# EAGLE board PinHeck (EAGLE 7.4.0), part 1 of 3
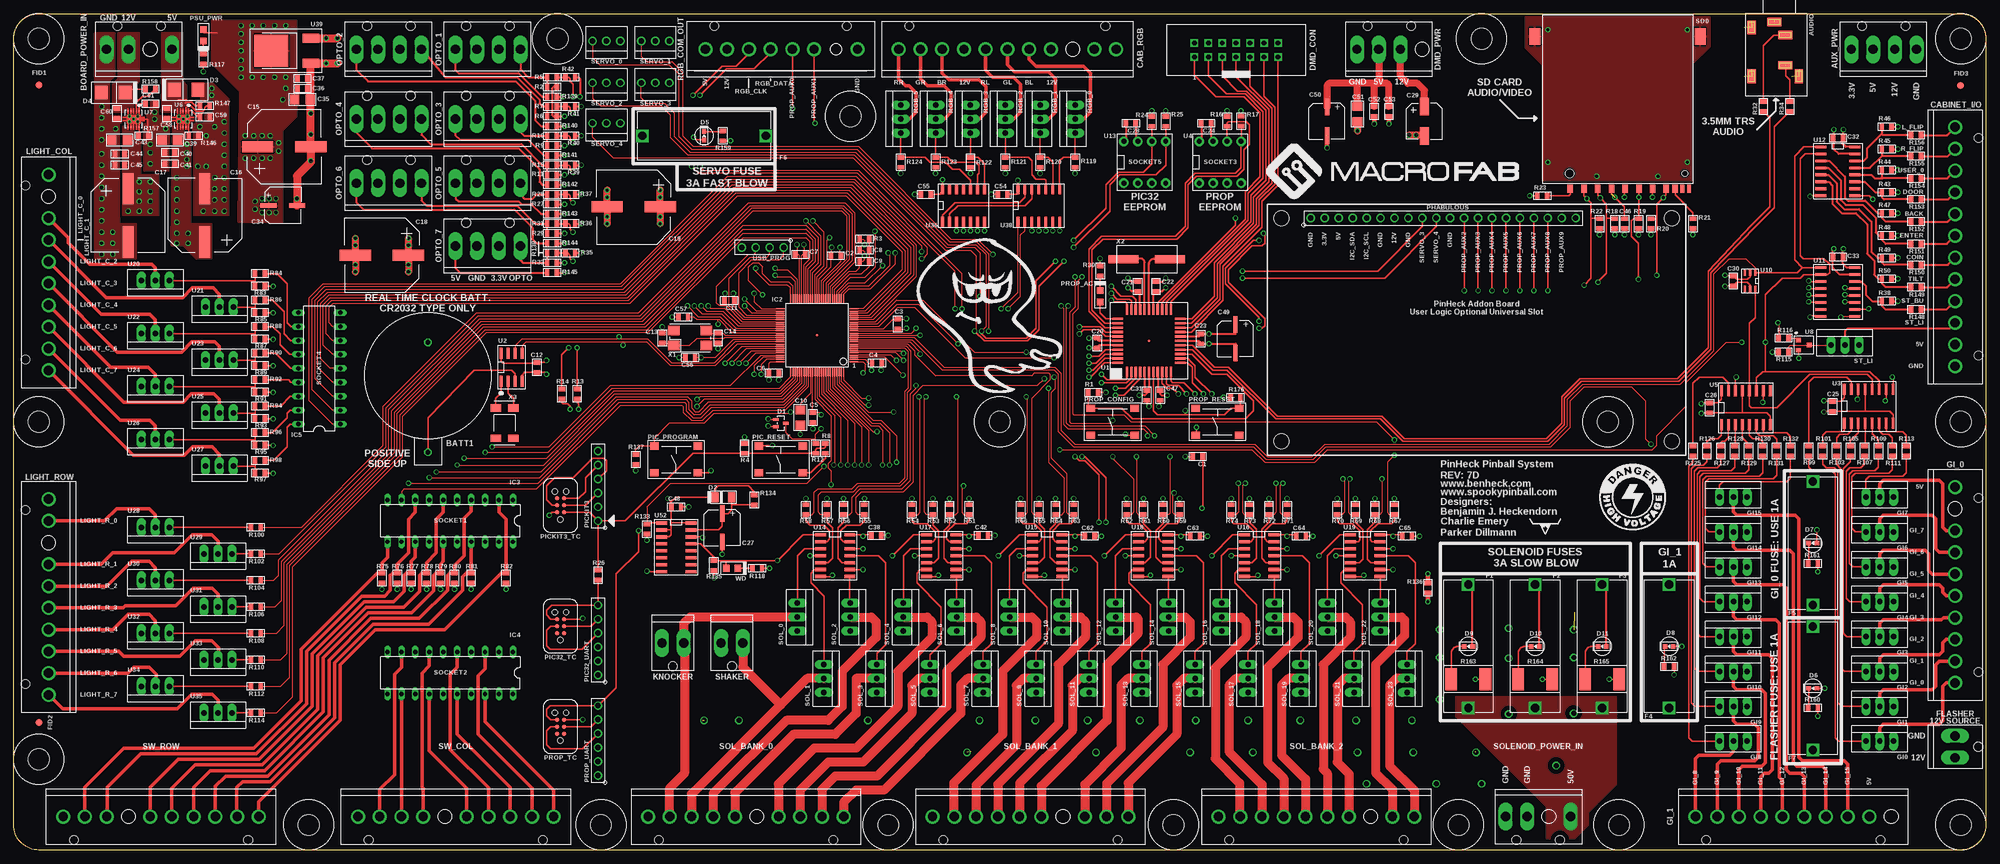
[diagram p8: board, top side]
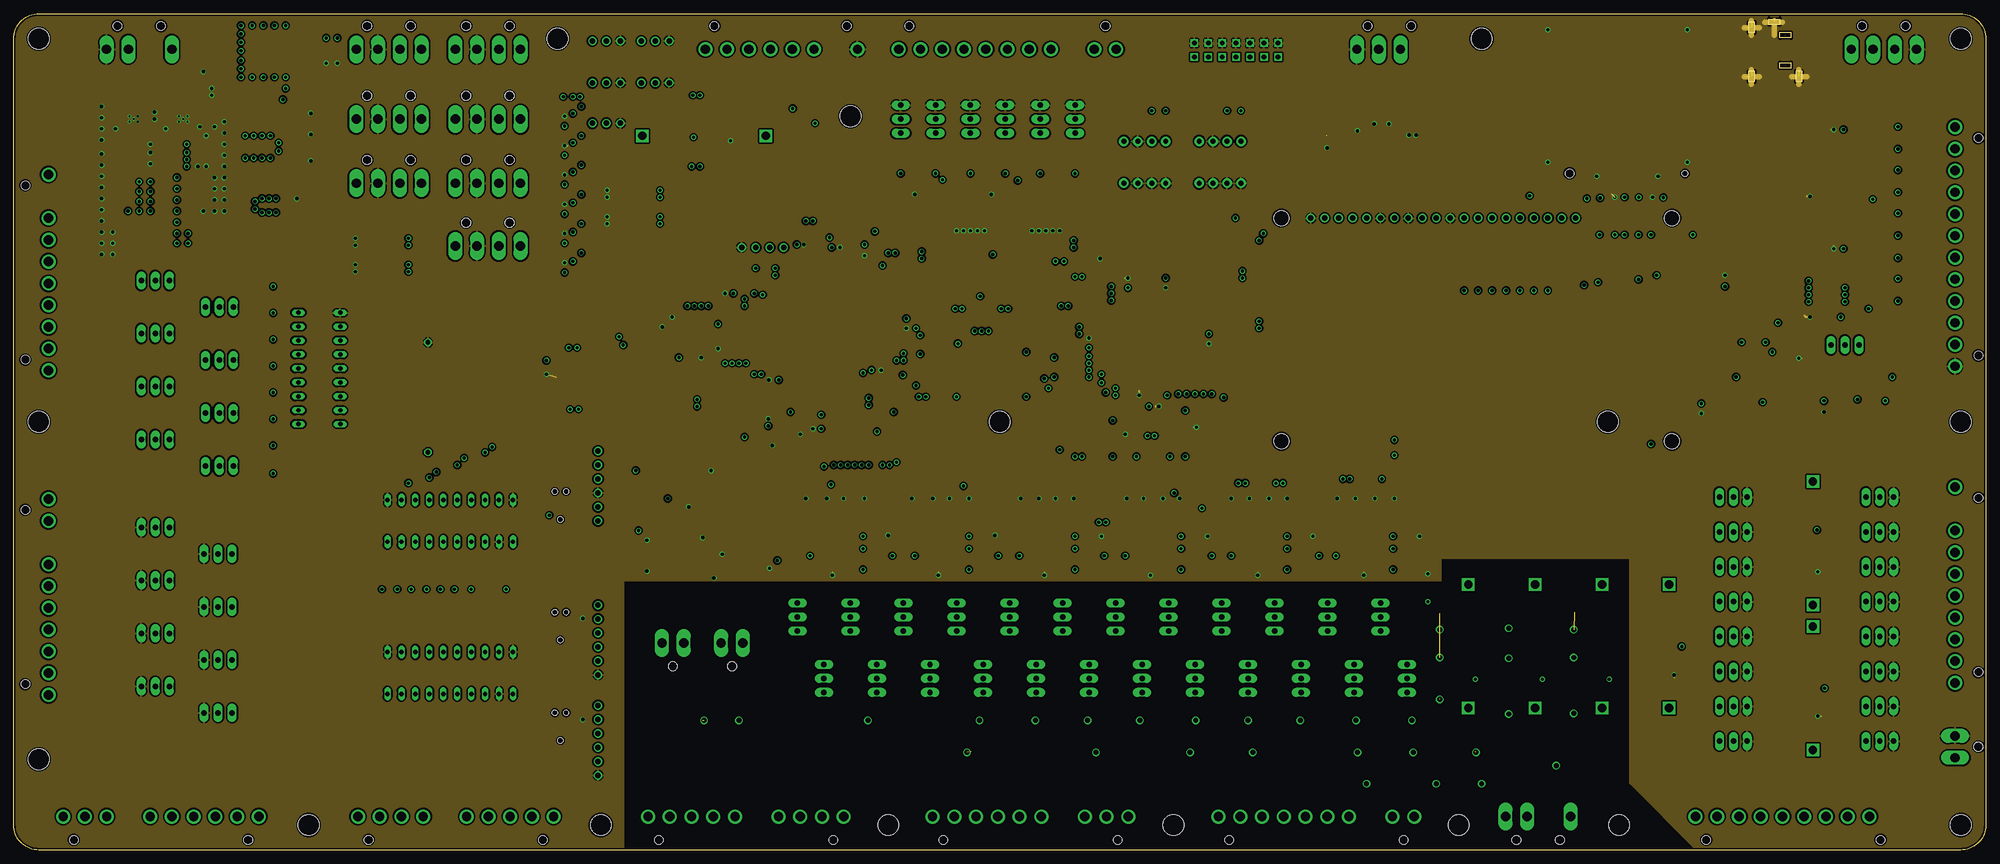
[diagram p9: board, inner layer GND]
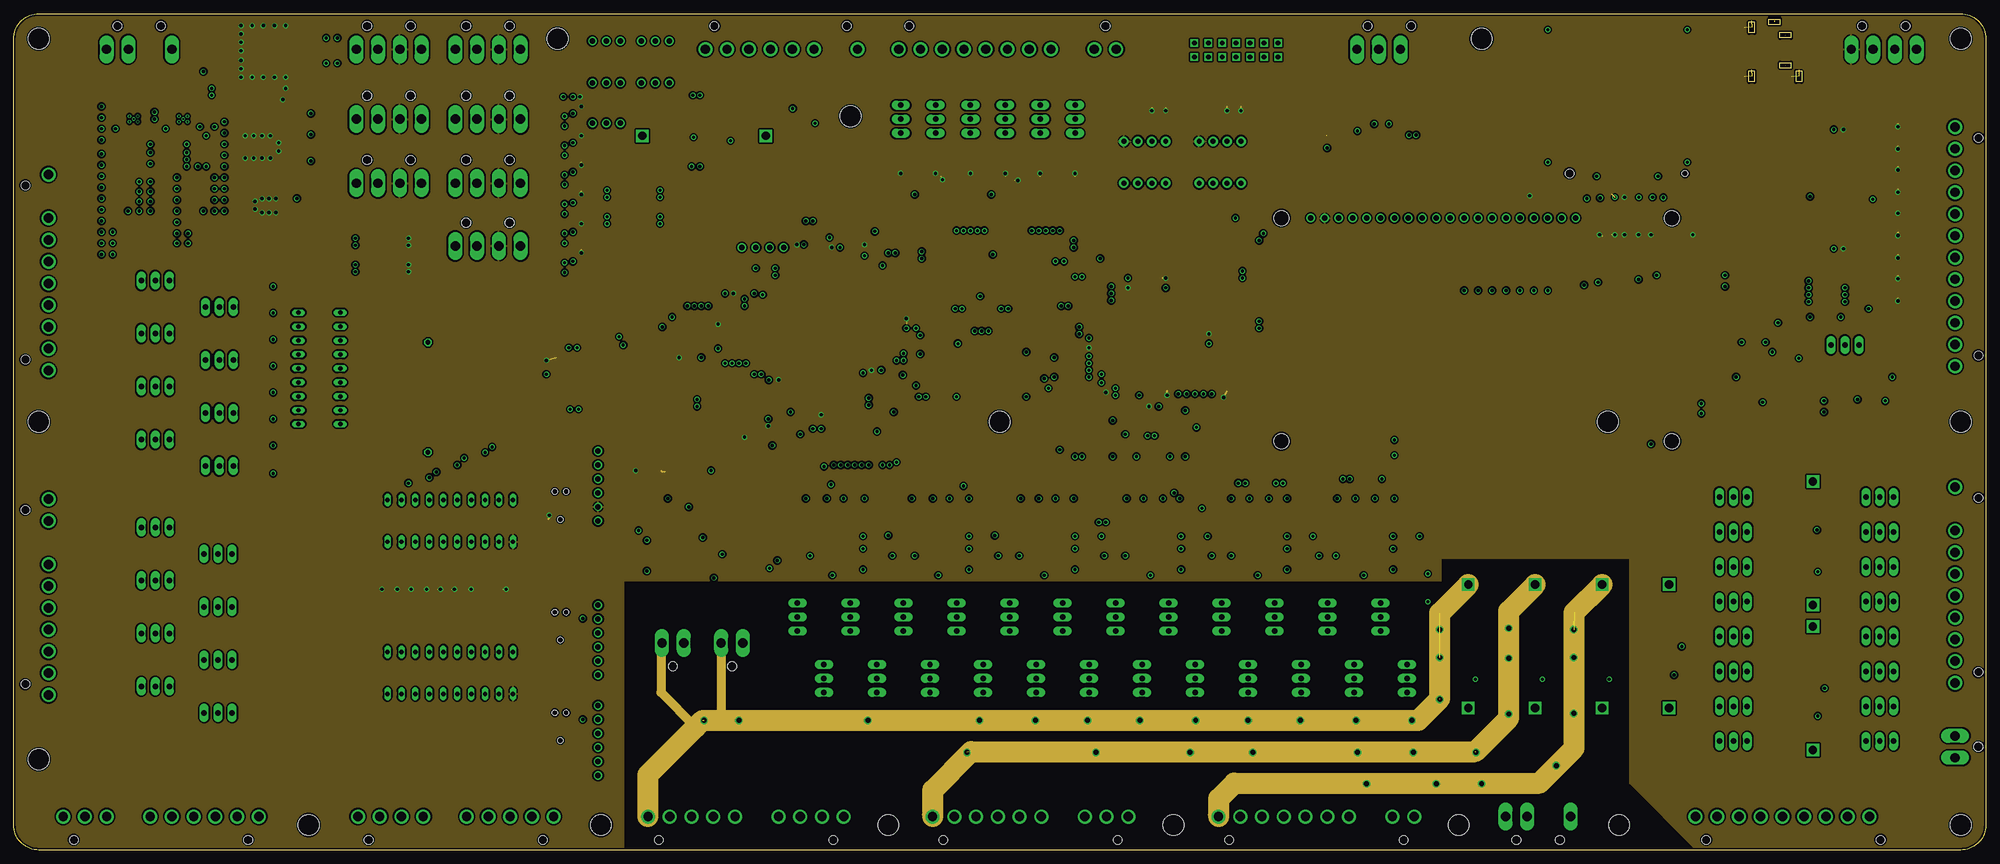
[diagram p10: board, inner layer 3.3V]
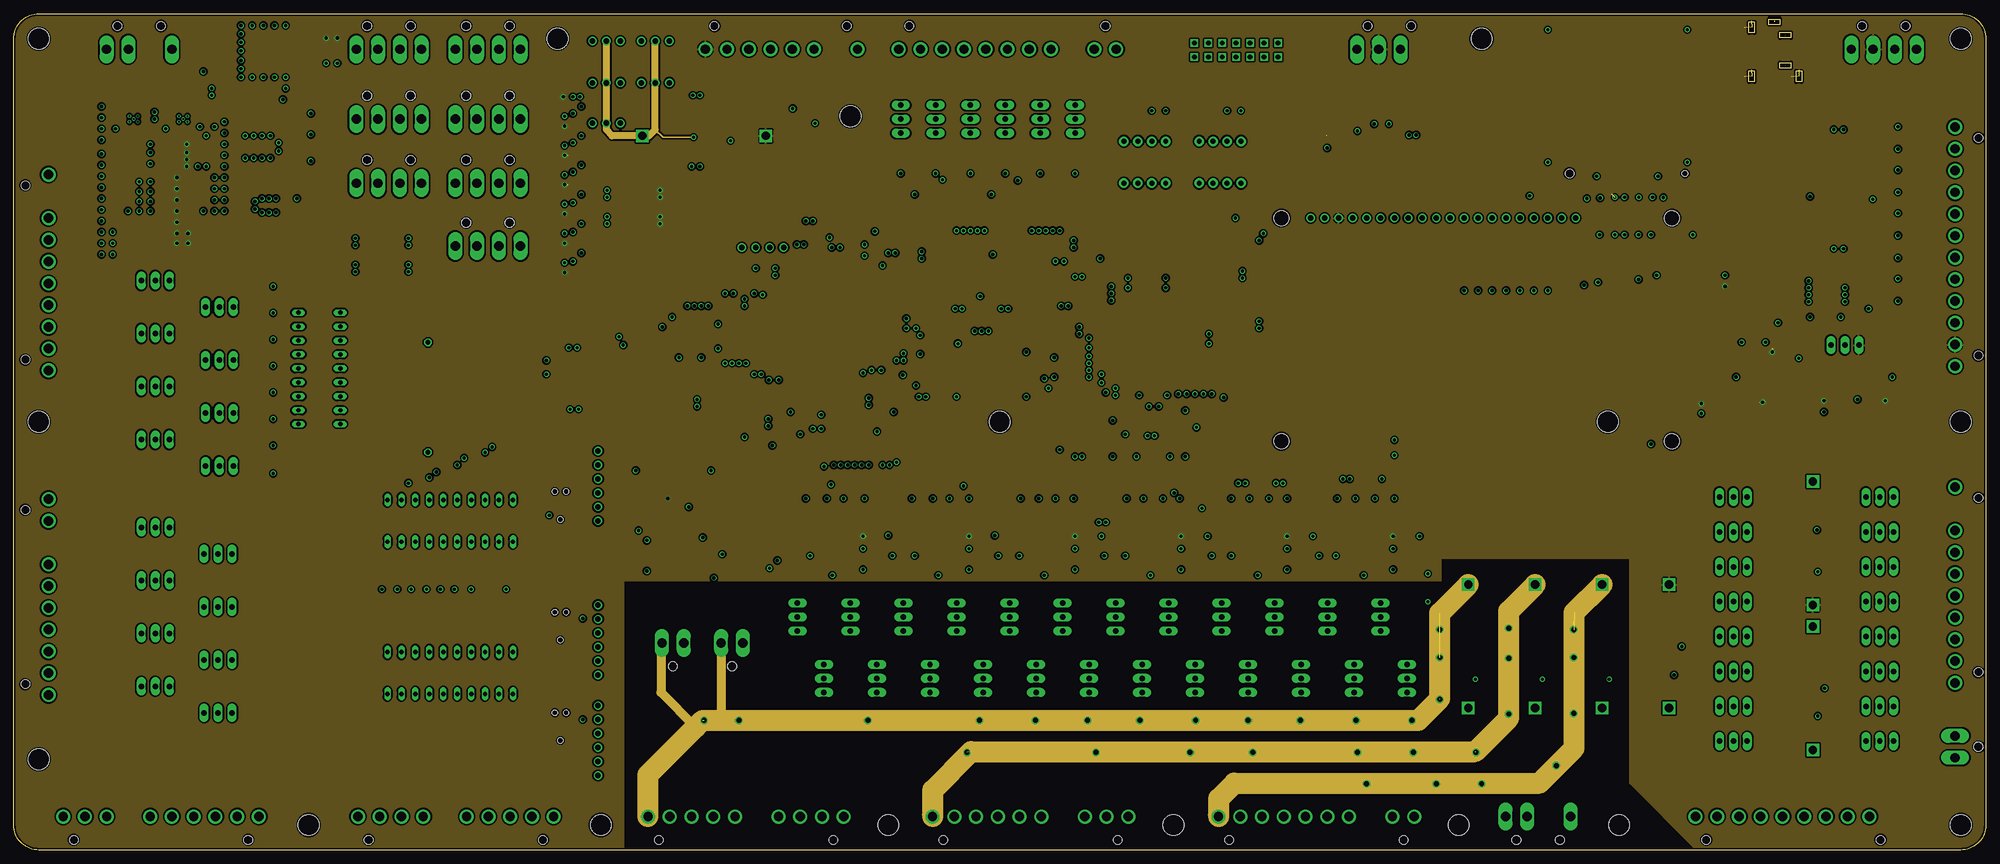
[diagram p11: board, inner layer 5V]
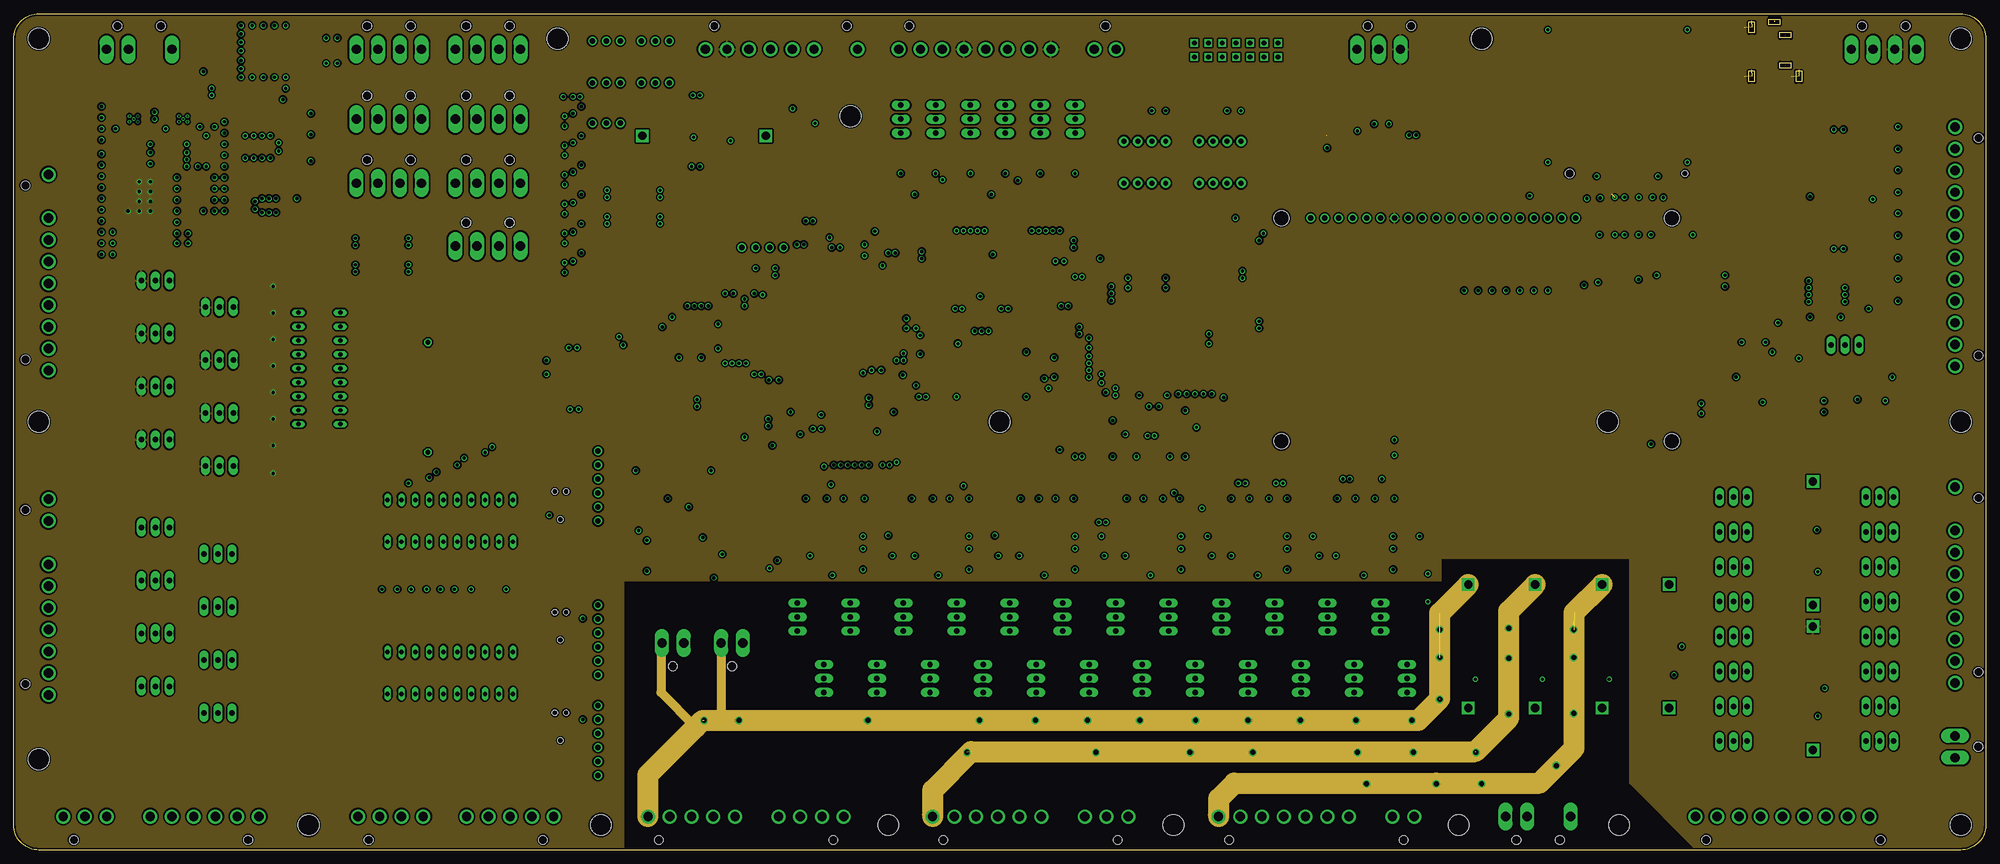
[diagram p12: board, inner layer 12V]
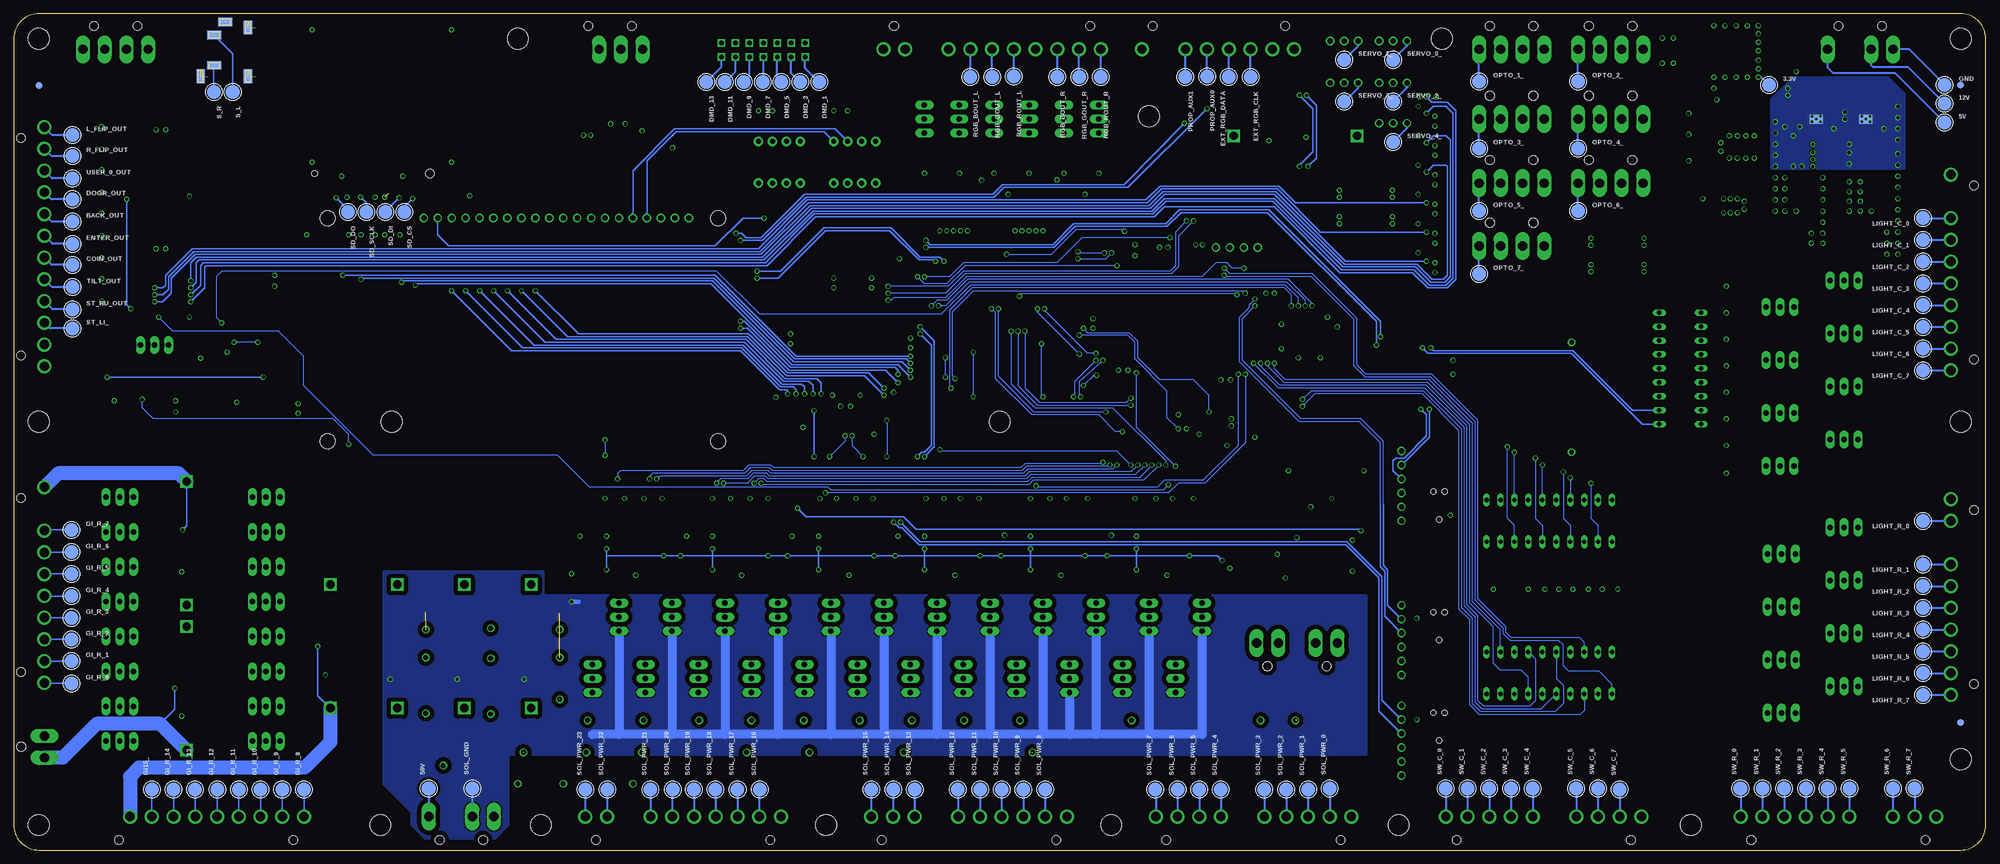
[diagram p13: board, bottom side, seen from below]

Size 359.16 x 152.27 mm. Coordinates in mm from the lower left corner, seen from the top.
Outline: 354.58,152.27 arc-90 359.16,147.7 359.16,4.57 arc-90 354.58,0 4.57,0 arc-90 0,4.57 0,147.7 arc-90 4.57,152.27 354.58,152.27
Copper layers (1*2*3*14*15*16): Top 0.035mm / dielectric 0.23mm / GND 0.035mm / dielectric 0.38mm / 3.3V 0.035mm / dielectric 0.15mm / 5V 0.035mm / dielectric 0.38mm / 12V 0.035mm / dielectric 0.23mm / Bottom 0.035mm
Design rules "MF_Standard_6_Layer": minimum track width 6mil, minimum drill 12mil, track to track 6mil, track to pad 6mil, pad to pad 6mil, via to via 6mil, smd to smd 0mil, copper to edge 10mil, drill to drill 10mil, minimum pad ring 6mil, minimum via ring 6mil, stop-mask expansion 2mil, vias tented up to drill 25mil, thermal gap 10mil
Net classes: 0 default: width 0.178 mm, drill 0.5 mm, clearance 0.178 mm
Holes 2.8 mm at 302.01,115.06 302.01,74.42 230.89,74.42 230.89,115.06

## Footprints (pad centres in the part's own frame; a part is rotated, then mirrored left to right if it is on the bottom)
100MIL_TP = smd 2.54 x 2.54: P$1 0,0
SJ1-3533NS = smd 1.5 x 2.5: 1_A -6,-0.4; 2_A -3.6,1.6; 3_A 1.9,1.6 | smd 1.5 x 2.5 bottom: 1_B -6,-0.4; 2_B -3.6,1.6; 3_B 1.9,1.6 | smd 2.5 x 1.5: S1 -5,-4.55; S2 3.9,-4.55; S3 3.9,4.05 | smd 2.5 x 1.5 bottom: S4 3.9,4.05; S5 3.9,-4.55; S6 -5,-4.55
26-64-4040 = drill 1.702 long: 1 -5.94,0; 2 -1.98,0; 3 1.98,0; 4 5.94,0 | hole 1.6: 3.96,-4.24; -3.96,-4.24
1066 = drill 0.889 octagon: NEG -6.071,0; POS 13.919,0
26-64-4040(KEYPIN2) = drill 1.702 long: 1 -5.94,0; 3 1.98,0; 4 5.94,0 | hole 1.6: 3.96,-4.24; -3.96,-4.24
0805 = smd 0.8 x 1.2: 1 -0.9,0; 2 0.9,0
1206 = smd 1.6 x 1.8: 1 -1.4,0; 2 1.4,0
CP12.5MM = smd 2 x 5.7: P$1 0,-4.85; P$2 0,4.85
6.3MM_CAP_SMD = smd 0.8 x 3: NEG 0,-2.6; POS 0,2.6
CP6.3MM = smd 1.6 x 3.2: P$1 0,-2.7; P$2 0,2.7
26-64-4110(KEYPIN3) = drill 1.7: P$1 -19.8,0; P$2 -15.84,0; P$3 -7.92,0; P$4 -3.96,0; P$5 0,0; P$6 3.96,0; P$7 7.92,0; P$8 11.88,0; P$9 15.84,0; P$10 19.8,0 | hole 1.6: -17.855,-4.24; 17.855,-4.24
26-64-4120 = drill 1.7: P$1 -21.78,0; P$2 -17.82,0; P$3 -13.86,0; P$4 -9.9,0; P$5 -5.94,0; P$6 -1.98,0; P$7 1.98,0; P$8 5.94,0; P$9 9.9,0; P$10 13.86,0; P$11 17.82,0; P$12 21.78,0 | hole 1.6: -19.8,-4.24; 19.8,-4.24
SOT-323 = smd 0.5 x 1: 1 -0.65,-0.9; 2 0.65,-0.9; 3 0,0.9
SOD-123 = smd 1.3 x 1.8: 1 -1.27,0; 2 1.73,0
SMBJ = smd 2.3 x 2.5: ANODE 2.15,0; CATH -2.15,0
LED0603 = smd 0.8 x 0.8: ANODE 0.75,0; CATHODE -0.75,0
5103308-2 = drill 0.9 square: 1 7.62,1.27; 2 7.62,-1.27; 3 5.08,1.27; 4 5.08,-1.27; 5 2.54,1.27; 6 2.54,-1.27; 7 0,1.27; 8 0,-1.27; 9 -2.54,1.27; 10 -2.54,-1.27; 11 -5.08,1.27; 12 -5.08,-1.27; 13 -7.62,1.27; 14 -7.62,-1.27
26-64-4040(KEYPIN1) = drill 1.702 long: 2 -1.98,0; 3 1.98,0; 4 5.94,0 | hole 1.6: 3.96,-4.24; -3.96,-4.24
4628 = drill 1.524 square: P$1 -11.252,0; P$2 11.252,0
FIDUCIAL_100MIL = smd 1.27 x 1.27: P$1 0,0 | smd 1.27 x 1.27 bottom: P$2 0,0
FIDUCIAL_0.5MM = smd 0.5 x 0.5: FID 0,0
26-64-4020 = drill 1.7 long: P$1 -1.98,0; P$2 1.98,0 | hole 1.63: 0,-4.24
TO-220AB = drill 1 pad 1.676 long: D 0,0; G 2.54,0; S -2.54,0
26-64-4100(KEYPIN9) = drill 1.7: P$1 -17.82,0; P$2 -13.86,0; P$3 -9.9,0; P$4 -5.94,0; P$5 -1.98,0; P$6 1.98,0; P$7 5.94,0; P$8 9.9,0; P$10 17.82,0 | hole 1.6: -15.875,-4.24; 15.875,-4.24
26-64-4100(KEYPIN10) = drill 1.7: P$1 -17.82,0; P$2 -13.86,0; P$3 -9.9,0; P$4 -5.94,0; P$5 -1.98,0; P$6 1.98,0; P$7 5.94,0; P$8 9.9,0; P$9 13.86,0 | hole 1.6: -15.875,-4.24; 15.875,-4.24
MOUNT_HOLE_150MIL = hole 3.81: 0,0
TQ100-PT = smd 1.5 x 0.2: 1 -6.7,4.8; 2 -6.7,4.4; 3 -6.7,4; 4 -6.7,3.6; 5 -6.7,3.2; 6 -6.7,2.8; 7 -6.7,2.4; 8 -6.7,2; 9 -6.7,1.6; 10 -6.7,1.2; 11 -6.7,0.8; 12 -6.7,0.4; 13 -6.7,0; 14 -6.7,-0.4; 15 -6.7,-0.8; 16 -6.7,-1.2; 17 -6.7,-1.6; 18 -6.7,-2; 19 -6.7,-2.4; 20 -6.7,-2.8; 21 -6.7,-3.2; 22 -6.7,-3.6; 23 -6.7,-4; 24 -6.7,-4.4; 25 -6.7,-4.8; 51 6.7,-4.8; 52 6.7,-4.4; 53 6.7,-4; 54 6.7,-3.6; 55 6.7,-3.2; 56 6.7,-2.8; 57 6.7,-2.4; 58 6.7,-2; 59 6.7,-1.6; 60 6.7,-1.2; 61 6.7,-0.8; 62 6.7,-0.4; 63 6.7,0; 64 6.7,0.4; 65 6.7,0.8; 66 6.7,1.2; 67 6.7,1.6; 68 6.7,2; 69 6.7,2.4; 70 6.7,2.8; 71 6.7,3.2; 72 6.7,3.6; 73 6.7,4; 74 6.7,4.4; 75 6.7,4.8 | smd 0.2 x 1.5: 26 -4.8,-6.7; 27 -4.4,-6.7; 28 -4,-6.7; 29 -3.6,-6.7; 30 -3.2,-6.7; 31 -2.8,-6.7; 32 -2.4,-6.7; 33 -2,-6.7; 34 -1.6,-6.7; 35 -1.2,-6.7; 36 -0.8,-6.7; 37 -0.4,-6.7; 38 0,-6.7; 39 0.4,-6.7; 40 0.8,-6.7; 41 1.2,-6.7; 42 1.6,-6.7; 43 2,-6.7; 44 2.4,-6.7; 45 2.8,-6.7; 46 3.2,-6.7; 47 3.6,-6.7; 48 4,-6.7; 49 4.4,-6.7; 50 4.8,-6.7; 76 4.8,6.7; 77 4.4,6.7; 78 4,6.7; 79 3.6,6.7; 80 3.2,6.7; 81 2.8,6.7; 82 2.4,6.7; 83 2,6.7; 84 1.6,6.7; 85 1.2,6.7; 86 0.8,6.7; 87 0.4,6.7; 88 0,6.7; 89 -0.4,6.7; 90 -0.8,6.7; 91 -1.2,6.7; 92 -1.6,6.7; 93 -2,6.7; 94 -2.4,6.7; 95 -2.8,6.7; 96 -3.2,6.7; 97 -3.6,6.7; 98 -4,6.7; 99 -4.4,6.7; 100 -4.8,6.7
DIL20 = drill 0.813 long: 1 -11.43,-3.81; 2 -8.89,-3.81; 3 -6.35,-3.81; 4 -3.81,-3.81; 5 -1.27,-3.81; 6 1.27,-3.81; 7 3.81,-3.81; 8 6.35,-3.81; 9 8.89,-3.81; 10 11.43,-3.81; 11 11.43,3.81; 12 8.89,3.81; 13 6.35,3.81; 14 3.81,3.81; 15 1.27,3.81; 16 -1.27,3.81; 17 -3.81,3.81; 18 -6.35,3.81; 19 -8.89,3.81; 20 -11.43,3.81
DIL18 = drill 0.813 long: 1 -10.16,-3.81; 2 -7.62,-3.81; 3 -5.08,-3.81; 4 -2.54,-3.81; 5 0,-3.81; 6 2.54,-3.81; 7 5.08,-3.81; 8 7.62,-3.81; 9 10.16,-3.81; 10 10.16,3.81; 11 7.62,3.81; 12 5.08,3.81; 13 2.54,3.81; 14 0,3.81; 15 -2.54,3.81; 16 -5.08,3.81; 17 -7.62,3.81; 18 -10.16,3.81
26-64-4100(KEYPIN2) = drill 1.7: P$1 -17.82,0; P$3 -9.9,0; P$4 -5.94,0; P$5 -1.98,0; P$6 1.98,0; P$7 5.94,0; P$8 9.9,0; P$9 13.86,0; P$10 17.82,0 | hole 1.6: -15.875,-4.24; 15.875,-4.24
26-64-4100(KEYPIN3) = drill 1.7: P$1 -17.82,0; P$2 -13.86,0; P$4 -5.94,0; P$5 -1.98,0; P$6 1.98,0; P$7 5.94,0; P$8 9.9,0; P$9 13.86,0; P$10 17.82,0 | hole 1.6: -15.875,-4.24; 15.875,-4.24
2.54MM_01X20_PIN_HEADER = drill 1: 1 -24.13,0; 2 -21.59,0; 3 -19.05,0; 4 -16.51,0; 5 -13.97,0; 6 -11.43,0; 7 -8.89,0; 8 -6.35,0; 9 -3.81,0; 10 -1.27,0; 11 1.27,0; 12 3.81,0; 13 6.35,0; 14 8.89,0; 15 11.43,0; 16 13.97,0; 17 16.51,0; 18 19.05,0; 19 21.59,0; 20 24.13,0
TC2030 = smd 0.787 x 0.787: P$1 -1.27,-0.635; P$2 -1.27,0.635; P$3 0,-0.635; P$4 0,0.635; P$5 1.27,-0.635; P$6 1.27,0.635 | hole 0.991: 2.54,1.016; 2.54,-1.016; -2.54,0
2.54MM_01X06_PIN_HEADER = drill 1: 1 -6.35,0; 2 -3.81,0; 3 -1.27,0; 4 1.27,0; 5 3.81,0; 6 6.35,0
TACT6MM = smd 1.55 x 1.3: P$1 -3.975,2.45; P$2 3.975,2.45; P$3 -3.975,-2.45; P$4 3.975,-2.45
LED_0805 = smd 1.2 x 1.2: ANODE 1.05,0; CATHODE -1.05,0
2512 = smd 2.1 x 4: 1 -3.1,0; 2 3.1,0
26-64-4080(KEYPIN2) = drill 1.7: P$1 -13.86,0; P$2 -5.94,0; P$3 -1.98,0; P$4 1.98,0; P$5 5.94,0; P$6 9.9,0; P$7 13.86,0 | hole 1.6: -11.915,-4.24; 12.215,-4.24
SD-RSMT-2-MQ = smd 1 x 1.5: 1 6.88,0; 2 4.38,0; 3 1.88,0; 4 -0.62,0; 5 -3.12,0; 6 -5.62,0; 7 -8.05,0; 8 -9.75,0; 9 9.38,0 | smd 0.7 x 1.5: CARD_DETECT -11.05,0; WP -12.25,0 | smd 2 x 3: GND_1 -14.28,-27.75; GND_2 15.82,-27.75 | hole 1.6: 9.5,-2.8 | hole 1.1: -11.5,-2.8
640454-3 = drill 1: P$1 -2.54,0; P$2 0,0; P$3 2.54,0
26-64-4100(KEYPIN6) = drill 1.7: P$1 -17.82,0; P$2 -13.86,0; P$3 -9.9,0; P$4 -5.94,0; P$5 -1.98,0; P$7 5.94,0; P$8 9.9,0; P$9 13.86,0; P$10 17.82,0 | hole 1.6: -15.875,-4.24; 15.875,-4.24
26-64-4100(KEYPIN7) = drill 1.7: P$1 -17.82,0; P$2 -13.86,0; P$3 -9.9,0; P$4 -5.94,0; P$5 -1.98,0; P$6 1.98,0; P$8 9.9,0; P$9 13.86,0; P$10 17.82,0 | hole 1.6: -15.875,-4.24; 15.875,-4.24
26-64-4100(KEYPIN8) = drill 1.7: P$1 -17.82,0; P$2 -13.86,0; P$3 -9.9,0; P$4 -5.94,0; P$5 -1.98,0; P$6 1.98,0; P$7 5.94,0; P$9 13.86,0; P$10 17.82,0 | hole 1.6: -15.875,-4.24; 15.875,-4.24
26-64-4040(KEYPIN3) = drill 1.702 long: 1 -5.94,0; 2 -1.98,0; 4 5.94,0 | hole 1.6: 3.96,-4.24; -3.96,-4.24
26-64-4100(KEYPIN5) = drill 1.7: P$1 -17.82,0; P$2 -13.86,0; P$3 -9.9,0; P$4 -5.94,0; P$6 1.98,0; P$7 5.94,0; P$8 9.9,0; P$9 13.86,0; P$10 17.82,0 | hole 1.6: -15.875,-4.24; 15.875,-4.24
26-64-4100(KEYPIN4) = drill 1.7: P$1 -17.82,0; P$2 -13.86,0; P$3 -9.9,0; P$5 -1.98,0; P$6 1.98,0; P$7 5.94,0; P$8 9.9,0; P$9 13.86,0; P$10 17.82,0 | hole 1.6: -15.875,-4.24; 15.875,-4.24
P8X32A_LQFP-44 = smd 1.9 x 0.4: 1 -5.7,4; 2 -5.7,3.2; 3 -5.7,2.4; 4 -5.7,1.6; 5 -5.7,0.8; 6 -5.7,0; 7 -5.7,-0.8; 8 -5.7,-1.6; 9 -5.7,-2.4; 10 -5.7,-3.2; 11 -5.7,-4; 23 5.7,-4; 24 5.7,-3.2; 25 5.7,-2.4; 26 5.7,-1.6; 27 5.7,-0.8; 28 5.7,0; 29 5.7,0.8; 30 5.7,1.6; 31 5.7,2.4; 32 5.7,3.2; 33 5.7,4 | smd 0.4 x 1.9: 12 -4,-5.7; 13 -3.2,-5.7; 14 -2.4,-5.7; 15 -1.6,-5.7; 16 -0.8,-5.7; 17 0,-5.7; 18 0.8,-5.7; 19 1.6,-5.7; 20 2.4,-5.7; 21 3.2,-5.7; 22 4,-5.7; 34 4,5.7; 35 3.2,5.7; 36 2.4,5.7; 37 1.6,5.7; 38 0.8,5.7; 39 0,5.7; 40 -0.8,5.7; 41 -1.6,5.7; 42 -2.4,5.7; 43 -3.2,5.7; 44 -4,5.7
DS1340Z_SOIC-8 = smd 2 x 0.5: 1 -2.55,1.905; 2 -2.55,0.635; 3 -2.55,-0.635; 4 -2.55,-1.905; 5 2.55,-1.905; 6 2.55,-0.635; 7 2.55,0.635; 8 2.55,1.905
CD74HC595_SOIC-16 = smd 2 x 0.5: 1 -3.1,4.445; 2 -3.1,3.175; 3 -3.1,1.905; 4 -3.1,0.635; 5 -3.1,-0.635; 6 -3.1,-1.905; 7 -3.1,-3.175; 8 -3.1,-4.445; 9 3.1,-4.445; 10 3.1,-3.175; 11 3.1,-1.905; 12 3.1,-0.635; 13 3.1,0.635; 14 3.1,1.905; 15 3.1,3.175; 16 3.1,4.445
DIP-8 = drill 0.9 pad 1.727: 1 -3.81,3.81; 2 -3.81,1.27; 3 -3.81,-1.27; 4 -3.81,-3.81; 5 3.81,-3.81; 6 3.81,-1.27; 7 3.81,1.27; 8 3.81,3.81
TPS2592(50/51/60/61)_VSON-10 = smd 0.2 x 0.2: P$1 -1,-1.5; P$2 -0.5,-1.5; P$3 0,-1.5; P$4 0.5,-1.5; P$5 1,-1.5; P$6 1,1.5; P$7 0.5,1.5; P$8 0,1.5; P$9 -0.5,1.5; P$10 -1,1.5; PAD -0.75,0 | drill 0.3 pad 0.3: PAD2 0,0; PAD3 0.75,0.5; PAD4 -0.75,0.5; PAD5 -0.75,-0.5; PAD6 0.75,-0.5 | smd 2.4 x 1.65 bottom: PAD7 0,0
SOT-23-3 = smd 0.8 x 0.9: P$1 -0.95,-1; P$2 0.95,-1; P$3 0,1
74HCT2G04_TTSOP-6 = smd 1.2 x 0.4: 1 -1.5,0.95; 2 -1.5,0; 3 -1.5,-0.95; 4 1.5,-0.95; 5 1.5,0; 6 1.5,0.95
CD74HC165_SOIC-16 = smd 2 x 0.5: 1 -3.1,4.445; 2 -3.1,3.175; 3 -3.1,1.905; 4 -3.1,0.635; 5 -3.1,-0.635; 6 -3.1,-1.905; 7 -3.1,-3.175; 8 -3.1,-4.445; 9 3.1,-4.445; 10 3.1,-3.175; 11 3.1,-1.905; 12 3.1,-0.635; 13 3.1,0.635; 14 3.1,1.905; 15 3.1,3.175; 16 3.1,4.445
MC74HC08_SOIC-14 = smd 2 x 0.6: 1 -2.66,3.81; 2 -2.66,2.54; 3 -2.66,1.27; 4 -2.66,0; 5 -2.66,-1.27; 6 -2.66,-2.54; 7 -2.66,-3.81; 8 2.66,-3.81; 9 2.66,-2.54; 10 2.66,-1.27; 11 2.66,0; 12 2.66,1.27; 13 2.66,2.54; 14 2.66,3.81
WS2801_SOP-14 = smd 1.8 x 0.5: 1 -2.95,3.81; 2 -2.95,2.54; 3 -2.95,1.27; 4 -2.95,0; 5 -2.95,-1.27; 6 -2.95,-2.54; 7 -2.95,-3.81; 8 2.95,-3.81; 9 2.95,-2.54; 10 2.95,-1.27; 11 2.95,0; 12 2.95,1.27; 13 2.95,2.54; 14 2.95,3.81
NCP1117DT_DPAK-3 = smd 1.6 x 3: 1 -2.285,-3.81; 3 2.285,-3.81 | smd 5.8 x 6.2: TAB 0,3.37
CD74HC123_SOIC-16 = smd 2 x 0.6: 1 -2.7,4.445; 2 -2.7,3.175; 3 -2.7,1.905; 4 -2.7,0.635; 5 -2.7,-0.635; 6 -2.7,-1.905; 7 -2.7,-3.175; 8 -2.7,-4.445; 9 2.7,-4.445; 10 2.7,-3.175; 11 2.7,-1.905; 12 2.7,-0.635; 13 2.7,0.635; 14 2.7,1.905; 15 2.7,3.175; 16 2.7,4.445
2.54MM_01X04_PIN_HEADER = drill 1: 1 -3.81,0; 2 -1.27,0; 3 1.27,0; 4 3.81,0
FQ7050B = smd 2.1 x 1.7: 1 -2.95,-1.35; 2 2.95,-1.35; 3 2.95,1.35; 4 -2.95,1.35
HC-49/US_SM = smd 5.5 x 1.5: P$1 -4.25,0; P$2 4.25,0
8MM_X_3.8MM = smd 1.3 x 1.9: 1 -2.75,-1.6; 2 2.75,-1.6; 3 2.75,1.6; 4 -2.75,1.6

## Placement (x,y rotation side)
3.3V  [100MIL_TP]  39.5,139.32 0 bottom
5V  [100MIL_TP]  7.49,132.46 0 bottom
12V  [100MIL_TP]  7.49,135.89 0 bottom
50V  [100MIL_TP]  283.59,11.18 90 bottom
AUDIO  SJ1-3533NS  [SJ1-3533NS]  321.06,144.78 270 top
AUX_PWR  26-64-4040  [26-64-4040]  340.61,145.8 180 top
BACK_OUT  [100MIL_TP]  348.49,114.43 0 bottom
BATT1  1066  [1066]  75.44,86.36 270 top
BOARD_POWER_IN  26-64-4040  [26-64-4040(KEYPIN2)]  22.86,145.8 180 top
C1  .1uF  [0805]  215.65,71.63 180 top
C2  .1uF  [0805]  149.73,108.2 0 top
C3  .1uF  [0805]  161.04,95.76 270 top
C4  .1uF  [0805]  157.23,88.65 0 top
C5  .1uF  [0805]  145.54,78.74 270 top
C6  .1uF  [0805]  138.43,86.87 180 top
C7  .1uF  [0805]  143.26,108.46 0 top
C8  1uF  [0805]  154.94,109.22 180 top
C9  .1uF  [0805]  154.94,107.19 180 top
C10  10uF  [1206]  143.26,78.74 270 top
C11  .1uF  [0805]  130.3,100.08 180 top
C12  .1uF  [0805]  95.25,87.88 90 top
C13  30pF  [0805]  118.11,93.22 90 top
C14  30pF  [0805]  128.27,93.22 270 top
C15  MF-CAP-12.5MM-1000uF  [CP12.5MM]  49.28,128.02 270 top
C16  MF-CAP-12.5MM-1000uF  [CP12.5MM]  34.8,115.57 0 top
C17  MF-CAP-12.5MM-1000uF  [CP12.5MM]  20.83,115.57 180 top
C18  MF-CAP-12.5MM-1000uF  [CP12.5MM]  67.06,108.33 90 top
C19  MF-CAP-12.5MM-1000uF  [CP12.5MM]  112.9,117.09 90 top
C20  .1uF  [0805]  197.36,92.3 270 top
C21  .1uF  [0805]  204.72,102.62 270 top
C22  .1uF  [0805]  208.03,102.62 90 top
C23  .1uF  [0805]  216.15,93.09 90 top
C24  .1uF  [0805]  217.17,132.33 180 top
C25  .1uF  [0805]  331.22,80.77 90 top
C26  .1uF  [0805]  308.86,80.52 90 top
C27  EEE-1VA101XP  [6.3MM_CAP_SMD]  129.03,58.67 0 top
C28  .1uF  [0805]  203.45,132.33 180 top
C29  MF-CAP-12.5MM-1000uF  [CP6.3MM]  256.92,132.72 180 top
C30  .1uF  [0805]  313.18,103.63 90 top
C31  .1uF  [0805]  206.35,82.8 270 top
C32  .1uF  [0805]  332.23,129.67 0 top
C33  .1uF  [0805]  332.23,107.95 0 top
C34  EEE-1VA101XP  [6.3MM_CAP_SMD]  49.02,117.35 90 top
C35  10uF  [1206]  52.58,136.65 0 top
C36  1uF  [0805]  52.58,138.68 0 top
C37  .1uF  [0805]  52.58,140.46 0 top
C38  .1uF  [0805]  157.1,57.28 0 top
C39  10uF  [1206]  28.45,129.29 180 top
C40  1uF  [0805]  28.45,127 180 top
C41  .1uF  [0805]  28.45,124.97 180 top
C42  .1uF  [0805]  176.53,57.28 0 top
C43  10uF  [1206]  19.3,129.29 180 top
C44  1uF  [0805]  19.3,126.75 180 top
C45  .1uF  [0805]  19.3,124.71 180 top
C46  .1uF  [0805]  293.37,114.05 270 top
C47  .1uF  [0805]  208.79,82.8 90 top
C48  1uF  [0805]  120.65,62.48 0 top
C49  EEE-1VA101XP  [6.3MM_CAP_SMD]  222.5,93.09 0 top
C50  EEE-1VA101XP  [6.3MM_CAP_SMD]  239.17,132.68 0 top
C51  10uF  [1206]  244.73,133.99 270 top
C52  1uF  [0805]  247.78,134.49 270 top
C53  .1uF  [0805]  250.44,134.49 270 top
C54  .1uF  [0805]  180.09,119.38 0 top
C55  .1uF  [0805]  166.12,119.38 0 top
C56  .1uF  [0805]  123.19,89.66 0 top
C57  .1uF  [0805]  121.92,97.03 180 top
C58  0.1uF  [0805]  27.94,134.11 270 top
C59  2.2nF  [0805]  34.8,133.48 0 top
C60  0.1uF  [0805]  18.8,134.11 270 top
C61  5.6nF  [0805]  24.89,135.89 0 top
C62  .1uF  [0805]  195.96,57.15 0 top
C63  .1uF  [0805]  215.14,57.15 0 top
C64  .1uF  [0805]  234.44,57.15 0 top
C65  .1uF  [0805]  253.75,57.15 0 top
CAB_RGB  26-64-4110  [26-64-4110(KEYPIN3)]  180.97,145.8 180 top
CABINET_I/O  26-64-4120  [26-64-4120]  353.57,109.86 90 top
COIN_OUT  [100MIL_TP]  348.49,106.55 0 bottom
D1  BAV99W,115  [SOT-323]  139.7,77.72 270 top
D2  CGRM4001-HF  [SOD-123]  129.03,64.26 0 top
D3  SMBJ6.0CA  [SMBJ]  31.37,138.43 0 top
D4  SMBJ15CA  [SMBJ]  18.16,137.92 180 top
D5  LO Q976-PS-25  [LED0603]  125.73,130.05 270 top
D6  LO Q976-PS-25  [LED0603]  327.66,29.46 0 top
D7  LO Q976-PS-25  [LED0603]  327.66,55.88 0 top
D8  LO Q976-PS-25  [LED0603]  301.5,37.08 0 top
D9  LO Q976-PS-25  [LED0603]  264.92,37.08 0 top
D10  LO Q976-PS-25  [LED0603]  277.11,37.08 0 top
D11  LO Q976-PS-25  [LED0603]  289.31,37.08 0 top
DMD_1  [100MIL_TP]  212.47,139.83 270 bottom
DMD_3  [100MIL_TP]  215.9,139.83 270 bottom
DMD_5  [100MIL_TP]  219.33,139.83 270 bottom
DMD_7  [100MIL_TP]  222.76,139.83 270 bottom
DMD_9  [100MIL_TP]  226.19,139.83 270 bottom
DMD_11  [100MIL_TP]  229.62,139.83 270 bottom
DMD_13  [100MIL_TP]  233.04,139.83 270 bottom
DMD_CON  5103308-2  [5103308-2]  222.63,145.67 180 top
DMD_PWR  [26-64-4040(KEYPIN1)]  250.57,145.8 180 top
DOOR_OUT  [100MIL_TP]  348.49,118.49 0 bottom
ENTER_OUT  [100MIL_TP]  348.49,110.36 0 bottom
EXT_RGB_CLK  [100MIL_TP]  133.89,140.72 270 bottom
EXT_RGB_DATA  [100MIL_TP]  137.85,140.72 270 bottom
F1  4628  [4628]  264.92,37.08 90 top
F2  4628  [4628]  277.11,37.08 90 top
F3  4628  [4628]  289.31,37.08 90 top
F4  4628  [4628]  301.5,37.08 270 top
F5  4628  [4628]  327.66,55.88 90 top
F6  4628  [4628]  125.73,130.05 180 top
F7  4628  [4628]  327.66,29.46 270 top
FID1  FIDUCIAL_100MIL  [FIDUCIAL_100MIL]  4.57,139.32 0 top
FID2  FIDUCIAL_100MIL  [FIDUCIAL_100MIL]  4.57,23.24 270 top
FID3  FIDUCIAL_100MIL  [FIDUCIAL_100MIL]  354.58,139.19 0 top
FID4  FIDUCIAL_0.5MM  [FIDUCIAL_0.5MM]  146.3,93.73 0 top
FID5  FIDUCIAL_0.5MM  [FIDUCIAL_0.5MM]  206.76,92.71 0 top
FLASHER  26-64-4020  [26-64-4020]  353.57,18.8 90 top
GI0  TIP102  [TO-220AB]  339.85,19.81 180 top
GI1  TIP102  [TO-220AB]  339.85,26.16 180 top
GI2  TIP102  [TO-220AB]  339.85,32.51 180 top
GI3  TIP102  [TO-220AB]  339.85,38.86 180 top
GI4  TIP102  [TO-220AB]  339.85,45.21 180 top
GI5  TIP102  [TO-220AB]  339.85,51.56 180 top
GI6  TIP102  [TO-220AB]  339.85,57.91 180 top
GI7  TIP102  [TO-220AB]  339.85,64.26 180 top
GI8  TIP102  [TO-220AB]  313.18,19.81 180 top
GI9  TIP102  [TO-220AB]  313.18,26.16 180 top
GI10  TIP102  [TO-220AB]  313.18,32.51 180 top
GI11  TIP102  [TO-220AB]  313.18,38.86 180 top
GI12  TIP102  [TO-220AB]  313.18,45.21 180 top
GI13  TIP102  [TO-220AB]  313.18,51.56 180 top
GI14  TIP102  [TO-220AB]  313.18,57.91 180 top
GI15  TIP102  [TO-220AB]  313.18,64.26 180 top
GI15_  [100MIL_TP]  334.01,11.05 90 bottom
GI_0  26-64-4100  [26-64-4100(KEYPIN9)]  353.57,48.26 90 top
GI_1  26-64-4100  [26-64-4100(KEYPIN10)]  324.1,6.1 0 top
GI_R_0  [100MIL_TP]  348.62,30.35 0 bottom
GI_R_1  [100MIL_TP]  348.62,34.42 0 bottom
GI_R_2  [100MIL_TP]  348.62,38.35 0 bottom
GI_R_3  [100MIL_TP]  348.62,42.29 0 bottom
GI_R_4  [100MIL_TP]  348.62,46.23 0 bottom
GI_R_5  [100MIL_TP]  348.62,50.29 0 bottom
GI_R_6  [100MIL_TP]  348.62,54.23 0 bottom
GI_R_7  [100MIL_TP]  348.62,58.29 0 bottom
GI_R_8  [100MIL_TP]  306.32,11.05 90 bottom
GI_R_9  [100MIL_TP]  310.26,11.05 90 bottom
GI_R_10  [100MIL_TP]  314.2,11.05 90 bottom
GI_R_11  [100MIL_TP]  318.13,11.05 90 bottom
GI_R_12  [100MIL_TP]  322.07,11.05 90 bottom
GI_R_13  [100MIL_TP]  326.14,11.05 90 bottom
GI_R_14  [100MIL_TP]  330.07,11.05 90 bottom
GND  [100MIL_TP]  7.49,139.32 0 bottom
H2  MOUNT_HOLE150MIL  [MOUNT_HOLE_150MIL]  290.32,77.98 0 top
H3  MOUNT_HOLE150MIL  [MOUNT_HOLE_150MIL]  179.58,77.98 0 top
H4  MOUNT_HOLE150MIL  [MOUNT_HOLE_150MIL]  152.4,133.6 0 top
H11  MOUNT_HOLE150MIL  [MOUNT_HOLE_150MIL]  4.57,16.51 0 top
H19  MOUNT_HOLE150MIL  [MOUNT_HOLE_150MIL]  4.57,77.98 0 top
H21  MOUNT_HOLE150MIL  [MOUNT_HOLE_150MIL]  4.57,147.7 0 top
H22  MOUNT_HOLE150MIL  [MOUNT_HOLE_150MIL]  99.06,147.7 0 top
H23  MOUNT_HOLE150MIL  [MOUNT_HOLE_150MIL]  53.72,4.57 0 top
H24  MOUNT_HOLE150MIL  [MOUNT_HOLE_150MIL]  106.93,4.57 0 top
H26  MOUNT_HOLE150MIL  [MOUNT_HOLE_150MIL]  159.26,4.57 0 top
H27  MOUNT_HOLE150MIL  [MOUNT_HOLE_150MIL]  211.2,4.57 0 top
H28  MOUNT_HOLE150MIL  [MOUNT_HOLE_150MIL]  263.14,4.57 0 top
H30  MOUNT_HOLE150MIL  [MOUNT_HOLE_150MIL]  267.33,147.7 0 top
H31  MOUNT_HOLE150MIL  [MOUNT_HOLE_150MIL]  292.35,4.57 0 top
H32  MOUNT_HOLE150MIL  [MOUNT_HOLE_150MIL]  354.58,4.57 0 top
H33  MOUNT_HOLE150MIL  [MOUNT_HOLE_150MIL]  354.58,77.98 0 top
H34  MOUNT_HOLE150MIL  [MOUNT_HOLE_150MIL]  354.58,147.7 0 top
IC2  PIC32MX795F512L-80I/PT  [TQ100-PT]  146.3,93.73 180 top
IC3  CD74HCT244E  [DIL20]  79.5,59.94 180 top
IC4  CD74HCT244E  [DIL20]  79.5,32.26 180 top
IC5  ULN2803A  [DIL18]  55.66,87.69 90 top
KNOCKER  26-64-4020  [26-64-4020]  120.05,37.72 0 top
L_FLIP_OUT  [100MIL_TP]  348.49,130.18 0 bottom
LIGHT_C_0  [100MIL_TP]  11.43,115.06 180 bottom
LIGHT_C_1  [100MIL_TP]  11.43,111.1 180 bottom
LIGHT_C_2  [100MIL_TP]  11.43,107.14 180 bottom
LIGHT_C_3  [100MIL_TP]  11.43,103.18 180 bottom
LIGHT_C_4  [100MIL_TP]  11.43,99.22 180 bottom
LIGHT_C_5  [100MIL_TP]  11.43,95.26 180 bottom
LIGHT_C_6  [100MIL_TP]  11.43,91.3 180 bottom
LIGHT_C_7  [100MIL_TP]  11.43,87.34 180 bottom
LIGHT_COL  26-64-4100  [26-64-4100(KEYPIN2)]  6.35,105.16 270 top
LIGHT_R_0  [100MIL_TP]  11.43,59.94 180 bottom
LIGHT_R_1  [100MIL_TP]  11.43,52.01 180 bottom
LIGHT_R_2  [100MIL_TP]  11.43,48.05 180 bottom
LIGHT_R_3  [100MIL_TP]  11.43,44.09 180 bottom
LIGHT_R_4  [100MIL_TP]  11.43,40.13 180 bottom
LIGHT_R_5  [100MIL_TP]  11.43,36.17 180 bottom
LIGHT_R_6  [100MIL_TP]  11.43,32.21 180 bottom
LIGHT_R_7  [100MIL_TP]  11.43,28.25 180 bottom
LIGHT_ROW  26-64-4100  [26-64-4100(KEYPIN3)]  6.35,46.07 270 top
LOGO1  SPOOKY_LOGOSPOOKY_LOGO  [SPOOKY_LOGO]  164.47,83.19 0 top
OPTO_1  26-64-4040  [26-64-4040]  86.36,145.8 180 top
OPTO_1_  [100MIL_TP]  92.3,139.95 0 bottom
OPTO_2  26-64-4040  [26-64-4040]  68.33,145.8 180 top
OPTO_2_  [100MIL_TP]  74.27,139.95 0 bottom
OPTO_3  26-64-4040  [26-64-4040]  86.36,133.1 180 top
OPTO_3_  [100MIL_TP]  92.3,127.76 0 bottom
OPTO_4  26-64-4040  [26-64-4040]  68.33,133.1 180 top
OPTO_4_  [100MIL_TP]  74.27,127.76 0 bottom
OPTO_5  26-64-4040  [26-64-4040]  86.36,121.41 180 top
OPTO_5_  [100MIL_TP]  92.3,116.33 0 bottom
OPTO_6  26-64-4040  [26-64-4040]  68.33,121.41 180 top
OPTO_6_  [100MIL_TP]  74.27,116.33 0 bottom
OPTO_7  26-64-4040  [26-64-4040]  86.36,109.98 180 top
OPTO_7_  [100MIL_TP]  92.3,104.9 0 bottom
PHABULOUS  26-64-4050  [2.54MM_01X20_PIN_HEADER]  260.35,115.06 0 top
PIC32_TC  TC2030-FTDI-TTL-232R  [TC2030]  99.57,40.77 90 top
PIC32_UART  [2.54MM_01X06_PIN_HEADER]  106.43,38.23 90 top
PIC_PROGRAM  [TACT6MM]  120.65,71.12 0 top
PIC_RESET  [TACT6MM]  139.7,71.12 0 top
PICKIT3  [2.54MM_01X06_PIN_HEADER]  106.43,66.29 90 top
PICKIT3_TC  TC2030-PKT-NL  [TC2030]  99.57,62.74 90 top
PROP_ACT  LG R971-KN-1  [LED_0805]  197.87,100.84 270 top
PROP_AUX0  [100MIL_TP]  141.81,140.84 270 bottom
PROP_AUX1  [100MIL_TP]  145.77,140.72 270 bottom
PROP_CONFIG  [TACT6MM]  200.15,77.98 0 top
PROP_RESET  [TACT6MM]  219.2,77.98 0 top
PROP_TC  TC2030-FTDI-TTL-232R  [TC2030]  99.57,22.48 90 top
PROP_UART  [2.54MM_01X06_PIN_HEADER]  106.43,19.94 90 top
PSU_PWR  LG R971-KN-1  [LED_0805]  34.54,148.34 90 top
R1  10K  [0805]  196.6,83.31 0 top
R2  2K  [0805]  98.04,138.94 180 top
R3  0  [0805]  154.94,111.25 0 top
R4  10K  [0805]  133.1,73.15 90 top
R5  1K  [0805]  98.04,140.72 180 top
R6  2K  [0805]  98.04,133.6 180 top
R7  1K  [0805]  98.04,135.38 180 top
R8  200  [0805]  147.83,73.15 90 top
R9  2K  [0805]  98.04,128.27 180 top
R10  1K  [0805]  98.04,130.05 180 top
R11  2K  [0805]  98.04,122.94 180 top
R12  50  [0805]  146.05,73.15 270 top
R13  50  [0805]  102.62,83.06 270 top
R14  50  [0805]  99.82,83.06 270 top
R15  1K  [0805]  98.04,124.71 180 top
R16  10K  [0805]  220.98,132.68 90 top
R17  10K  [0805]  223.55,132.72 90 top
R18  10K  [0805]  291.59,114.05 90 top
R19  10K  [0805]  295.91,114.05 90 top
R20  10K  [0805]  298.2,114.05 90 top
R21  10K  [0805]  305.82,114.05 90 top
R22  10K  [0805]  288.8,114.05 90 top
R23  10K  [0805]  278.38,119.13 0 top
R24  10K  [0805]  207.26,132.68 90 top
R25  10K  [0805]  209.8,132.68 90 top
R26  100  [0805]  106.43,50.04 90 top
R27  2K  [0805]  98.04,117.6 180 top
R28  1K  [0805]  98.04,119.38 180 top
R29  2K  [0805]  98.04,112.27 180 top
R30  360  [0805]  197.87,105.41 270 top
R31  1K  [0805]  98.04,114.05 180 top
R32  4.7K  [0805]  318.64,135.38 90 top
R33  2K  [0805]  98.04,106.93 180 top
R34  4.7K  [0805]  323.47,135.38 90 top
R35  10K  [0805]  101.35,108.71 0 top
R36  10K  [0805]  101.35,114.05 0 top
R37  10K  [0805]  101.35,119.38 0 top
R38  10K  [0805]  341.12,99.95 0 top
R39  10K  [0805]  101.35,124.71 0 top
R40  10K  [0805]  101.35,130.05 0 top
R41  10K  [0805]  101.35,135.38 0 top
R42  10K  [0805]  101.35,140.72 0 top
R43  10K  [0805]  341.12,119.76 0 top
R44  10K  [0805]  341.12,123.83 0 top
R45  10K  [0805]  341.12,127.64 0 top
R46  10K  [0805]  341.12,131.7 0 top
R47  10K  [0805]  341.12,115.95 0 top
R48  10K  [0805]  341.12,111.89 0 top
R49  10K  [0805]  341.12,107.82 0 top
R50  10K  [0805]  341.12,104.01 0 top
R51  10K  [0805]  173.99,61.98 270 top
R52  10K  [0805]  170.43,61.98 270 top
R53  10K  [0805]  167.39,61.98 270 top
R54  10K  [0805]  163.58,61.98 270 top
R55  10K  [0805]  154.94,61.98 270 top
R56  10K  [0805]  151.13,61.98 270 top
R57  10K  [0805]  148.08,61.98 270 top
R58  10K  [0805]  144.27,61.98 270 top
R59  10K  [0805]  212.34,61.98 270 top
R60  10K  [0805]  209.3,61.98 270 top
R61  10K  [0805]  205.74,61.98 270 top
R62  10K  [0805]  202.69,61.98 270 top
R63  10K  [0805]  193.04,61.98 270 top
R64  10K  [0805]  189.74,61.98 270 top
R65  10K  [0805]  186.69,61.98 270 top
R66  10K  [0805]  183.39,61.98 270 top
R67  10K  [0805]  251.46,61.98 270 top
R68  10K  [0805]  247.9,61.98 270 top
R69  10K  [0805]  244.35,61.98 270 top
R70  10K  [0805]  241.05,61.98 270 top
R71  10K  [0805]  231.9,61.98 270 top
R72  10K  [0805]  228.6,61.98 270 top
R73  10K  [0805]  225.04,61.98 270 top
R74  10K  [0805]  221.74,61.98 270 top
R75  10K  [0805]  67.06,49.53 90 top
R76  10K  [0805]  69.85,49.53 90 top
R77  10K  [0805]  72.39,49.53 90 top
R78  10K  [0805]  75.18,49.53 90 top
R79  10K  [0805]  77.72,49.53 270 top
R80  10K  [0805]  80.26,49.53 270 top
R81  10K  [0805]  83.31,49.53 270 top
R82  10K  [0805]  89.66,49.53 270 top
R83  10K  [0805]  44.83,102.68 180 top
R84  360  [0805]  44.83,104.97 180 top
R85  10K  [0805]  44.83,97.85 180 top
R86  360  [0805]  44.83,100.14 180 top
R87  10K  [0805]  44.83,93.03 180 top
R88  360  [0805]  44.83,95.31 180 top
R89  10K  [0805]  44.83,88.2 180 top
R90  360  [0805]  44.83,90.49 180 top
R91  10K  [0805]  44.83,83.38 180 top
R92  360  [0805]  44.83,85.66 180 top
R93  10K  [0805]  44.83,78.55 180 top
R94  360  [0805]  44.83,80.84 180 top
R95  10K  [0805]  44.83,73.72 180 top
R96  360  [0805]  44.83,76.01 180 top
R97  10K  [0805]  44.83,68.64 180 top
R98  360  [0805]  44.83,70.93 180 top
R99  360  [0805]  326.9,72.64 270 top
R100  360  [0805]  44.07,58.77 180 top
R101  360  [0805]  329.44,72.64 270 top
R102  360  [0805]  44.07,53.94 180 top
R103  360  [0805]  331.98,72.64 270 top
R104  360  [0805]  44.07,49.12 180 top
R105  360  [0805]  334.52,72.64 270 top
R106  360  [0805]  44.07,44.29 180 top
R107  360  [0805]  337.06,72.64 270 top
R108  360  [0805]  44.07,39.47 180 top
R109  360  [0805]  339.6,72.64 270 top
R110  360  [0805]  44.07,34.64 180 top
R111  360  [0805]  342.14,72.64 270 top
R112  360  [0805]  44.07,29.81 180 top
R113  360  [0805]  344.68,72.64 270 top
R114  360  [0805]  44.07,24.99 180 top
R115  10K  [0805]  322.33,90.68 0 top
R116  360  [0805]  322.33,93.22 180 top
R117  360  [0805]  34.54,144.02 90 top
R118  360  [0805]  135.38,51.31 0 top
R119  10K  [0805]  193.29,125.22 270 top
R120  10K  [0805]  186.94,125.22 270 top
R121  10K  [0805]  180.59,125.22 270 top
R122  10K  [0805]  174.24,125.22 270 top
R123  10K  [0805]  167.89,125.22 270 top
R124  10K  [0805]  161.54,125.22 270 top
R125  360  [0805]  305.82,72.64 270 top
R126  360  [0805]  308.36,72.64 270 top
R127  360  [0805]  310.9,72.64 270 top
R128  360  [0805]  313.44,72.64 270 top
R129  360  [0805]  315.98,72.64 270 top
R130  360  [0805]  318.52,72.64 270 top
R131  360  [0805]  321.06,72.64 270 top
R132  360  [0805]  323.6,72.64 270 top
R133  10K  [0805]  115.32,58.42 270 top
R134  25K  [0805]  134.87,63.75 90 top
R135  10K  [0805]  127.51,51.82 270 top
R136  0  [0805]  257.56,47.75 270 top
R137  10K  [0805]  113.28,71.12 270 top
R138  1K  [0805]  98.04,108.71 180 top
R139  200  [0805]  98.04,137.16 180 top
R140  200  [0805]  98.04,131.83 180 top
R141  200  [0805]  98.04,126.49 180 top
R142  200  [0805]  98.04,121.16 180 top
R143  200  [0805]  98.04,115.82 180 top
R144  200  [0805]  98.04,110.49 180 top
R145  200  [0805]  98.04,105.16 180 top
R146  130K  [0805]  32.77,130.05 0 top
R147  1M  [0805]  34.8,135.51 0 top
R148  100  [0805]  346.46,98.42 180 top
R149  100  [0805]  346.46,102.49 180 top
R150  100  [0805]  346.46,106.55 180 top
R151  100  [0805]  346.46,110.36 180 top
R152  100  [0805]  346.46,114.43 180 top
R153  100  [0805]  346.46,118.49 180 top
R154  100  [0805]  346.46,122.3 180 top
R155  100  [0805]  346.46,126.36 180 top
R156  100  [0805]  346.46,130.18 180 top
R157  110K  [0805]  23.62,130.05 0 top
R158  1M  [0805]  24.89,138.56 0 top
R159  180  [0805]  129.16,130.05 270 top
R160  680  [0805]  327.66,25.91 0 top
R161  180  [0805]  327.66,52.2 0 top
R162  180  [0805]  301.5,33.4 0 top
R163  CRCW25125K60JNEG  [2512]  264.92,31.11 0 top
R164  CRCW25125K60JNEG  [2512]  277.11,31.11 0 top
R165  CRCW25125K60JNEG  [2512]  289.31,31.11 0 top
R176  10K  [0805]  222.5,82.42 180 top
R_FLIP_OUT  [100MIL_TP]  348.49,126.36 0 bottom
RGB_0  RFP12N10L  [TO-220AB]  193.29,133.1 270 top
RGB_1  RFP12N10L  [TO-220AB]  186.94,133.1 270 top
RGB_2  RFP12N10L  [TO-220AB]  180.59,133.1 270 top
RGB_3  RFP12N10L  [TO-220AB]  174.24,133.1 270 top
RGB_4  RFP12N10L  [TO-220AB]  167.89,133.1 270 top
RGB_5  RFP12N10L  [TO-220AB]  161.54,133.1 270 top
RGB_BOUT_L  [100MIL_TP]  184.94,140.72 270 bottom
RGB_BOUT_R  [100MIL_TP]  169.09,140.72 270 bottom
RGB_COM_OUT  26-64-4080  [26-64-4080(KEYPIN2)]  139.83,145.8 180 top
RGB_GOUT_L  [100MIL_TP]  180.97,140.72 270 bottom
RGB_GOUT_R  [100MIL_TP]  165.13,140.72 270 bottom
RGB_ROUT_L  [100MIL_TP]  177.01,140.84 270 bottom
RGB_ROUT_R  [100MIL_TP]  161.18,140.72 270 bottom
S_L  [100MIL_TP]  319.28,138.05 270 bottom
S_R  [100MIL_TP]  322.71,138.05 270 bottom
SD0  SD-RSMT-2-MQ  [SD-RSMT-2-MQ]  292.86,120.4 180 top
SD_CS  [100MIL_TP]  288.04,116.2 270 bottom
SD_DI  [100MIL_TP]  291.46,116.2 270 bottom
SD_DO  [100MIL_TP]  298.32,116.2 270 bottom
SD_SCLK  [100MIL_TP]  294.89,116.2 270 bottom
SERVO_0  640454-3  [640454-3]  107.95,147.32 180 top
SERVO_0_  [100MIL_TP]  107.95,143.89 0 bottom
SERVO_1  640454-3  [640454-3]  116.84,147.32 180 top
SERVO_1_  [100MIL_TP]  116.84,143.89 0 bottom
SERVO_2  640454-3  [640454-3]  107.95,139.7 180 top
SERVO_2_  [100MIL_TP]  107.95,136.27 0 bottom
SERVO_3  640454-3  [640454-3]  116.84,139.7 180 top
SERVO_3_  [100MIL_TP]  116.84,136.27 0 bottom
SERVO_4  640454-3  [640454-3]  107.95,132.33 180 top
SERVO_4_  [100MIL_TP]  107.95,128.91 0 bottom
SHAKER  26-64-4020  [26-64-4020]  130.81,37.72 0 top
SOCKET1  820-AG11D-ESL-LF  [20PIN_DIP_SOCKET]  79.5,59.94 180 top
SOCKET2  820-AG11D-ESL-LF  [20PIN_DIP_SOCKET]  79.5,32.26 180 top
SOCKET3  808-AG11D-ESL-LF  [8PIN_DIP_SOCKET]  219.71,125.22 0 top
SOCKET4  818-AG11D-ESL-LF  [18PIN_DIP_SOCKET]  55.66,87.69 90 top
SOCKET5  808-AG11D-ESL-LF  [8PIN_DIP_SOCKET]  205.99,125.22 0 top
SOL_0  IRL530PBF  [TO-220AB]  142.75,42.42 90 top
SOL_1  IRL530PBF  [TO-220AB]  147.57,31.24 90 top
SOL_2  IRL530PBF  [TO-220AB]  152.4,42.42 90 top
SOL_3  IRL530PBF  [TO-220AB]  157.23,31.24 90 top
SOL_4  IRL530PBF  [TO-220AB]  162.05,42.42 90 top
SOL_5  IRL530PBF  [TO-220AB]  166.88,31.24 90 top
SOL_6  IRL530PBF  [TO-220AB]  171.7,42.42 90 top
SOL_7  IRL530PBF  [TO-220AB]  176.53,31.24 90 top
SOL_8  IRL530PBF  [TO-220AB]  181.36,42.42 90 top
SOL_9  IRL530PBF  [TO-220AB]  186.18,31.24 90 top
SOL_10  IRL530PBF  [TO-220AB]  191.01,42.42 90 top
SOL_11  IRL530PBF  [TO-220AB]  195.83,31.24 90 top
SOL_12  IRL530PBF  [TO-220AB]  200.66,42.42 90 top
SOL_13  IRL530PBF  [TO-220AB]  205.49,31.24 90 top
SOL_14  IRL530PBF  [TO-220AB]  210.31,42.42 90 top
SOL_15  IRL530PBF  [TO-220AB]  215.14,31.24 90 top
SOL_16  IRL530PBF  [TO-220AB]  219.96,42.42 90 top
SOL_17  IRL530PBF  [TO-220AB]  224.79,31.24 90 top
SOL_18  IRL530PBF  [TO-220AB]  229.62,42.42 90 top
SOL_19  IRL530PBF  [TO-220AB]  234.44,31.24 90 top
SOL_20  IRL530PBF  [TO-220AB]  239.27,42.42 90 top
SOL_21  IRL530PBF  [TO-220AB]  244.09,31.24 90 top
SOL_22  IRL530PBF  [TO-220AB]  248.92,42.42 90 top
SOL_23  IRL530PBF  [TO-220AB]  253.75,31.24 90 top
SOL_BANK_0  26-64-4100  [26-64-4100(KEYPIN6)]  133.35,6.1 0 top
SOL_BANK_1  26-64-4100  [26-64-4100(KEYPIN7)]  185.17,6.1 0 top
SOL_BANK_2  26-64-4100  [26-64-4100(KEYPIN8)]  237.24,6.1 0 top
SOL_GND  [100MIL_TP]  275.59,11.18 90 bottom
SOL_PWR_0  [100MIL_TP]  119.51,11.18 90 bottom
SOL_PWR_1  [100MIL_TP]  123.44,11.05 90 bottom
SOL_PWR_2  [100MIL_TP]  127.38,11.05 90 bottom
SOL_PWR_3  [100MIL_TP]  131.44,11.05 90 bottom
SOL_PWR_4  [100MIL_TP]  139.32,11.05 90 bottom
SOL_PWR_5  [100MIL_TP]  143.26,11.05 90 bottom
SOL_PWR_6  [100MIL_TP]  147.19,11.05 90 bottom
SOL_PWR_7  [100MIL_TP]  151.26,11.05 90 bottom
SOL_PWR_8  [100MIL_TP]  171.32,11.05 90 bottom
SOL_PWR_9  [100MIL_TP]  175.26,11.05 90 bottom
SOL_PWR_10  [100MIL_TP]  179.2,11.05 90 bottom
SOL_PWR_11  [100MIL_TP]  183.13,11.05 90 bottom
SOL_PWR_12  [100MIL_TP]  187.2,11.05 90 bottom
SOL_PWR_13  [100MIL_TP]  195.07,11.05 90 bottom
SOL_PWR_14  [100MIL_TP]  199.01,11.05 90 bottom
SOL_PWR_15  [100MIL_TP]  202.95,11.05 90 bottom
SOL_PWR_16  [100MIL_TP]  223.27,11.05 90 bottom
SOL_PWR_17  [100MIL_TP]  227.33,11.05 90 bottom
SOL_PWR_18  [100MIL_TP]  231.39,11.05 90 bottom
SOL_PWR_19  [100MIL_TP]  235.33,11.05 90 bottom
SOL_PWR_20  [100MIL_TP]  239.14,11.05 90 bottom
SOL_PWR_21  [100MIL_TP]  243.21,11.05 90 bottom
SOL_PWR_22  [100MIL_TP]  251.08,11.05 90 bottom
SOL_PWR_23  [100MIL_TP]  255.02,11.05 90 bottom
SOLENOID_POWER_IN  26-64-4040  [26-64-4040(KEYPIN3)]  277.62,6.1 0 top
ST_BU_OUT  [100MIL_TP]  348.49,98.42 0 bottom
ST_LI  NDP6020P  [TO-220AB]  333.5,91.95 180 top
ST_LI_  [100MIL_TP]  348.49,95 0 bottom
SW_C_0  [100MIL_TP]  98.34,11.18 90 bottom
SW_C_1  [100MIL_TP]  94.38,11.18 90 bottom
SW_C_2  [100MIL_TP]  90.42,11.18 90 bottom
SW_C_3  [100MIL_TP]  86.46,11.18 90 bottom
SW_C_4  [100MIL_TP]  82.5,11.18 90 bottom
SW_C_5  [100MIL_TP]  74.58,11.18 90 bottom
SW_C_6  [100MIL_TP]  70.62,11.18 90 bottom
SW_C_7  [100MIL_TP]  66.66,11.05 90 bottom
SW_COL  26-64-4100  [26-64-4100(KEYPIN5)]  80.52,6.1 0 top
SW_R_0  [100MIL_TP]  44.7,11.18 90 bottom
SW_R_1  [100MIL_TP]  40.69,11.18 90 bottom
SW_R_2  [100MIL_TP]  36.73,11.18 90 bottom
SW_R_3  [100MIL_TP]  32.77,11.18 90 bottom
SW_R_4  [100MIL_TP]  28.81,11.18 90 bottom
SW_R_5  [100MIL_TP]  24.85,11.18 90 bottom
SW_R_6  [100MIL_TP]  16.93,11.18 90 bottom
SW_R_7  [100MIL_TP]  12.95,11.18 90 bottom
SW_ROW  26-64-4100  [26-64-4100(KEYPIN4)]  26.83,6.1 0 top
SYM1  HIGH_VOLTAGE_500MIL  [HIGH_VOLTAGE_500MIL]  288.54,57.91 0 top
TILT_OUT  [100MIL_TP]  348.49,102.49 0 bottom
U1  P8X32A-Q44  [P8X32A_LQFP-44]  206.76,92.71 90 top
U2  DS1340Z-33+  [DS1340Z_SOIC-8]  90.68,87.88 90 top
U3  CD74HC595M96  [CD74HC595_SOIC-16]  337.82,80.77 90 top
U4  CAT24M01LI-G  [DIP-8]  219.71,125.22 90 top
U5  CD74HC595M96  [CD74HC595_SOIC-16]  315.47,80.52 90 top
U6  TPS259251  [TPS2592(50/51/60/61)_VSON-10]  30.86,133.1 180 top
U7  TPS259261  [TPS2592(50/51/60/61)_VSON-10]  21.84,133.1 180 top
U8  MF-DSC-SOT233-MMBT3904  [SOT-23-3]  326.01,91.95 270 top
U10  74HCT2G04GV,125  [74HCT2G04_TTSOP-6]  316.23,103.63 270 top
U11  74HC165D-Q100,118  [CD74HC165_SOIC-16]  332.23,101.6 0 top
U12  74HC165D-Q100,118  [CD74HC165_SOIC-16]  332.23,123.57 0 top
U13  CAT24M01LI-G  [DIP-8]  205.99,125.22 90 top
U14  MC74HC08ADR2G  [MC74HC08_SOIC-14]  149.61,53.59 0 top
U15  MC74HC08ADR2G  [MC74HC08_SOIC-14]  188.21,53.59 0 top
U16  MC74HC08ADR2G  [MC74HC08_SOIC-14]  226.82,53.59 0 top
U17  MC74HC08ADR2G  [MC74HC08_SOIC-14]  168.91,53.59 0 top
U18  MC74HC08ADR2G  [MC74HC08_SOIC-14]  207.52,53.59 0 top
U19  MC74HC08ADR2G  [MC74HC08_SOIC-14]  246.13,53.59 0 top
U20  TIP107  [TO-220AB]  25.78,103.7 0 top
U21  TIP107  [TO-220AB]  37.47,98.87 0 top
U22  TIP107  [TO-220AB]  25.78,94.04 0 top
U23  TIP107  [TO-220AB]  37.47,89.22 0 top
U24  TIP107  [TO-220AB]  25.78,84.39 0 top
U25  TIP107  [TO-220AB]  37.47,79.57 0 top
U26  TIP107  [TO-220AB]  25.78,74.74 0 top
U27  TIP107  [TO-220AB]  37.47,69.91 0 top
U28  TIP102  [TO-220AB]  25.78,58.77 0 top
U29  TIP102  [TO-220AB]  37.21,53.94 0 top
U30  TIP102  [TO-220AB]  25.78,49.12 0 top
U31  TIP102  [TO-220AB]  37.21,44.29 0 top
U32  TIP102  [TO-220AB]  25.78,39.47 0 top
U33  TIP102  [TO-220AB]  37.21,34.64 0 top
U34  TIP102  [TO-220AB]  25.78,29.81 0 top
U35  TIP102  [TO-220AB]  37.21,24.99 0 top
U36  WS2801  [WS2801_SOP-14]  172.97,117.35 90 top
U38  WS2801  [WS2801_SOP-14]  186.69,117.35 90 top
U39  NCP1117DT33G  [NCP1117DT_DPAK-3]  50.29,145.54 90 top
U52  CD74HC123M96  [CD74HC123_SOIC-16]  120.65,55.12 0 top
U$1  LHE_LOGOLHE_LOGO  [LHE_LOGO]  280.92,57.4 0 top
U$2  MF_LOGOLOGO_TEXT  [MF_LOGO_TEXT]  228.35,118.49 0 top
USB_PROG  N/A  [2.54MM_01X04_PIN_HEADER]  136.4,109.73 180 top
USER_0_OUT  [100MIL_TP]  348.49,122.3 0 bottom
WD  LG R971-KN-1  [LED_0805]  130.81,51.31 180 top
X1  FQ7050B-8.000  [FQ7050B]  123.19,93.22 0 top
X2  9C-6.500MAAJ-T  [HC-49/US_SM]  206.35,107.57 0 top
X3  ABS25-32.768KHz-1-T  [8MM_X_3.8MM]  89.41,77.72 270 top

## Tracks (layer width: path | path; a pad name or v marks a point on that pad's centre or on a via)
3.3V  (via drill 0.6)
  Top 0.203: IC2.46 143.1,108.2 142.85,108.46 C7.1 142.62,108.72 v142.62,110.24 | v148.97,109.73 148.97,107.95 C2.1 148.83,106.16 146.7,104.03 IC2.37 | IC2.16 158.43,94.93 160.16,96.66 C3.1 162.42,96.66 v162.56,96.77 | R3.1 154.69,111.25 154.94,111 v154.94,110.24 | IC2.86 145.5,79.68 145.8,79.68 | 145.8,79.68 146.64,79.68 v147.07,79.25 | C5.1 145.76,79.64 145.8,79.68 | IC2.2 155.02,89.33 155.7,88.65 C4.1 156.33,87.49 v156.21,87.38 | IC2.55 133.2,96.93 131.2,98.92 C11.1 131.2,101.21 v131.06,101.35 | D1.2 137.56,77.07 v137.41,77.22 | R137.2 v113.28,69.09 | C56.1 v121.16,89.66 | IC2.62 130.92,94.13 128.52,96.52 128.27,96.52 | C57.1 123.95,97.03 124.46,96.52 128.27,96.52 | v128.27,95.76 128.27,96.52 | v139.32,85.6 139.32,86.86 C6.1
  Top 0.254: PSU_PWR.ANODE 34.58,148.84 37.08,148.84 | R119.2 v193.29,123.19 | R120.2 v186.94,123.19 | R121.2 v180.59,123.19 | R122.2 v174.24,123.19 | R123.2 v167.89,123.19 | R124.2 v161.54,123.19 | v169.16,122.05 U36.14 168.91,119.63 168.66,119.38 C55.2 | v182.88,121.92 U38.14 182.88,119.63 182.63,119.38 C54.2 | SD0.4 293.37,120.28 v293.37,118.87 | C46.2 v293.37,112.01 | R19.1 v295.91,112.01 | R21.1 v305.82,112.01 | R1.2 v198.88,83.31 | R176.2 v220.34,82.42 | R16.2 v220.98,134.62 | R17.2 223.52,133.65 v223.52,134.62 | R25.2 v209.8,134.62 | R24.2 v207.26,134.62 | R82.2 v89.66,47.5 | R81.2 v83.31,47.5 | R80.2 v80.26,47.5 | R79.2 v77.72,47.5 | R78.1 v75.18,47.5 | R77.1 v72.39,47.5 | R76.1 v69.85,47.5 | R75.1 v67.06,47.5 | PICKIT3_TC.P$2 98.04,61.47 v97.54,60.96 | R4.2 v133.1,75.18 | R23.1 v276.1,119.13 | R18.1 v291.59,112.01 | R22.1 v288.8,112.01 | R20.1 v298.2,112.01
  Top 0.305: U2.8 88.77,89.03 89.15,88.65 95.11,88.65 C12.2 96.66,88.78 v97.03,89.15
  Top 0.406: R37.2 v103.38,119.38 | R35.2 v103.38,108.71 | R36.2 v103.38,114.05 | R46.2 v343.15,131.7 | R45.2 v343.15,127.64 | R44.2 v343.15,123.83 | R43.2 v343.15,119.76 | R47.2 v343.15,115.95 | R48.2 v343.15,111.89 | R49.2 v343.15,107.82 | R50.2 v343.15,104.01 | R38.2 v343.15,99.95 | U12.16 333.63,128.02 333.13,128.51 C32.2 333.25,129.78 v333.25,131.19 | U11.16 333.88,106.05 333.13,106.8 C33.2 333.13,109.36 v333.25,109.47 | U1.40 197.86,91.91 arc90 C20.2 195.87,91.4 v195.83,91.44 | U1.30 205.16,101.28 arc90 C21.2 203.59,101.72 v202.95,102.36 | U1.18 215.67,93.51 arc90 C23.2 217.67,93.99 v217.68,93.98 222.5,93.98 C49.POS | U1.8 208.36,83.75 C47.2 208.79,83.06 209.04,82.8 v210.06,82.8 | C31.2 206.35,81.18 v206.76,80.77 | C22.2 209.18,103.52 v209.8,104.14 | R40.2 v103.38,130.05 | R39.2 v103.38,124.71 | R41.2 v103.38,135.38 | R42.2 102.87,140.72 103.12,140.46 v103.12,137.16 | C28.2 202.55,129.4 U13.8 | C24.2 216.27,129.4 U4.8
  Top 1.27: C18.P$1 71.88,108.36 v71.88,111.38 | 71.86,108.33 71.88,108.31 v71.88,105.28
  3.3V 0.203: v148.97,109.73 148.72,109.73 | v162.56,96.77 162.56,95.76 | v154.94,110.24 154.69,110.24 | v147.07,79.25 146.81,79.25 | v156.21,87.38 155.7,87.38 | v137.41,77.22 137.41,77.47 | v113.28,69.09 113.28,68.83 | v121.16,89.66 120.9,89.92
  3.3V 0.254: v193.29,123.19 193.29,122.68 | v186.94,123.19 186.94,122.68 | v180.59,123.19 180.59,122.68 | v167.89,123.19 167.64,123.19 | v161.54,123.19 161.8,123.19 | v169.16,122.05 168.91,122.68 | v182.88,121.92 182.37,121.92 | v198.88,83.31 198.88,83.82 | v220.34,82.42 220.98,83.57 | v220.98,134.62 220.98,135.38 | v223.52,134.62 223.52,135.38 | v209.8,134.62 209.8,135.13 | v207.26,134.62 207.26,135.13 | v89.66,47.5 89.15,47.5 | v83.31,47.5 82.8,47.5 | v80.26,47.5 79.76,47.5 | v77.72,47.5 77.22,47.5 | v75.18,47.5 74.93,47.5 | v72.39,47.5 71.88,47.5 | v69.85,47.5 69.34,47.5 | v67.06,47.5 66.8,47.5 | 118.62,68.83 118.11,68.83 117.86,69.09 | v97.54,60.96 97.54,60.45 97.28,60.2 | v291.59,112.01 291.08,112.01 | v288.8,112.01 289.05,112.01 289.31,111.76 | v298.2,112.01 297.69,112.01
  3.3V 0.305: v97.03,89.15 98.81,89.66
  3.3V 0.406: v103.38,130.05 103.38,130.3 | v103.38,124.71 103.38,125.22 | v103.38,119.38 103.38,119.89 | v103.38,108.71 103.38,109.22 | v103.38,114.05 103.38,114.3 | v343.15,131.7 343.15,132.21 | v343.15,127.64 343.15,128.14 | v343.15,123.83 343.15,124.33 | v343.15,119.76 343.15,120.27 | v343.15,115.95 343.15,116.2 | v343.15,111.89 343.15,112.39 | v343.15,107.82 343.15,108.33 | v343.15,104.01 343.15,104.52 | v343.15,99.95 343.15,100.46 | v206.76,80.77 207.01,80.77 | v210.06,82.8 210.06,83.57 | v209.8,104.14 209.3,104.14 | v217.68,93.98 217.68,93.73
  Bottom 0.406: 3.3V.P$1 40.89,140.72 v41.4,140.72
  other vias: 49.53,150.11 47.5,150.11 45.47,150.11 43.43,150.11 49.53,140.72 47.5,140.72 45.47,140.72 43.43,140.72 41.4,142.24 41.4,150.11 41.4,148.59 41.4,145.54 41.4,143.76 41.4,147.07 49.53,138.68 49.02,136.65 42.16,130.05 43.69,130.05 45.21,130.05 46.74,130.05 46.74,125.98 45.21,125.98 43.69,125.98 42.16,125.98 48.26,128.78 48.26,127.25 43.94,116.71 43.94,118.11 45.21,116.08 46.48,116.08 47.75,116.08 45.21,118.62 46.48,118.62 47.75,118.62 71.88,110.11 71.88,106.55
  pour 3.3V (isolate 0.305, rank 6): 0,152.15 359.16,152.15 359.16,0 306.53,0 294.39,12.14 294.39,53.09 259.84,53.09 259.84,49.02 111,49.02 111,0 0,0
  pour Top (isolate 0.406, rank 6): 51.56,151.13 51.56,133.6 49.02,131.06 49.02,114.3 40.89,114.3 41.15,138.18 36.07,143.26 36.07,151.13
5V  (via drill 0.6)
  Top 0.254: U14.14 154.43,57.4 | 154.43,57.4 v154.69,57.15 | U17.14 173.74,57.4 | 173.74,57.4 v173.99,57.15 | U15.14 193.04,57.4 | 193.04,57.4 v193.29,57.15 | U18.14 212.34,57.4 | 212.34,57.4 v212.6,57.15 | U16.14 231.65,57.4 | 231.65,57.4 v231.9,57.15 | U19.14 250.95,57.4 | 250.95,57.4 v251.21,57.15 | U5.16 311.02,82.05 310.39,81.42 C26.2 307.34,81.42 v307.34,81.28 | U5.10 318.64,81.66 v318.52,81.53 | v329.69,81.79 329.81,81.67 C25.2 332.74,81.67 333.38,82.31 U3.16 | U3.10 341,81.79 v340.87,81.79 | U10.5 316.23,102.87 315.72,103.38 313.83,103.38 C30.1 311.77,102.73 v311.66,102.62 | C38.1 156.07,57.4 154.43,57.4 | C42.1 175.5,57.4 173.74,57.4 | C62.1 194.81,57.4 193.04,57.4 | C63.1 213.98,57.4 212.34,57.4 | C64.1 233.29,57.4 231.65,57.4 | C65.1 252.59,57.4 250.95,57.4
  Top 0.305: 119.75,63.38 C48.1 119.75,59.56 | 119.75,63.38 v119.13,64.01 | 119.75,63.38 120.63,64.26 D2.1 127.76,65.79 128.27,66.29 133.86,66.29 134.87,65.28 R134.2 | 119.75,59.56 119.75,58.28 | 119.75,58.28 119.25,58.29 U52.2 | U52.3 119.36,57.02 119.75,57.41 119.75,58.28 | U52.16 119.75,59.56
  Top 0.406: R139.1 v100.08,137.16 | R140.1 v100.33,131.83 | R145.1 v100.33,105.16 | R144.1 v100.33,110.49 | R143.1 v100.33,115.82 | R142.1 v100.33,121.16 | R141.1 v100.33,126.49 | R115.1 v320.29,90.68
  Top 1.27: 244.73,139.57 239.51,139.57 239.17,139.24 C50.POS | C51.1 244.73,139.57 | C52.1 247.78,139.57 | 247.78,139.57 244.73,139.57 | C53.1 250.44,139.29 250.16,139.57 248.59,139.57 | DMD_PWR.3 248.59,139.57 | 248.59,139.57 247.78,139.57 | C19.P$1 117.73,117.12 v117.73,120.14 | 117.73,117.07 v117.73,114.05
  Top 1.422: U39.3 v58.93,147.83
  5V 0.254: v154.69,57.15 155.19,57.15 | v173.99,57.15 173.99,56.64 | v193.29,57.15 193.29,56.64 | v212.6,57.15 212.6,56.64 | v231.9,57.15 231.9,56.64 | v251.21,57.15 251.21,56.64 | v307.34,81.28 307.34,81.03 | v318.52,81.53 318.01,81.53 | v329.69,81.79 329.69,82.04 | v340.87,81.79 340.61,81.79 | v311.66,102.62 311.4,102.62
  5V 0.305: v119.13,64.01 118.87,63.75
  5V 0.406: v100.08,137.16 100.33,137.41 | v100.33,131.83 100.33,132.08 | v100.33,105.16 100.33,105.41 | v100.33,110.49 100.33,110.74 | v100.33,115.82 100.58,115.82 | v100.33,121.16 100.84,121.16 | v100.33,126.49 100.84,126.49 | v320.29,90.68 320.29,91.19
  other vias: 56.9,147.83 117.73,118.87 117.73,115.32 31.5,125.73 31.5,124.46 31.5,128.52 31.5,127 29.72,122.43 29.72,120.4 29.72,118.36 29.72,116.33 29.72,114.3 31.75,112.27 31.75,110.49 29.72,112.27 29.72,110.49
  pour 5V (isolate 0.305, rank 6): 0,152.15 359.16,152.15 359.16,0 306.53,0 294.39,12.14 294.39,53.09 259.84,53.09 259.84,49.02 111,49.02 111,0 0,0
  pour Top (no thermals): 28.96,131.83 28.7,109.98 30.99,109.98 33.27,107.7 36.07,107.7 36.07,114.05 32.26,114.05 32.26,129.03 30.99,129.03 30.99,131.83
5V_IN
  Top 0.254: 30.48,136.65 29.97,136.65 29.99,136.64 | 30.48,136.65 31.5,136.65 | 30.49,136.64 30.48,136.65 | R147.1 33.02,135.51 32.38,136.14 31.37,136.14 31.24,136.02
  Bottom 0.406: 5V.P$1 16.51,141.48 27.81,141.48 28.8,142.47 BOARD_POWER_IN.1
  pour Top (no thermals): 30.73,148.84 26.92,148.84 26.92,134.37 31.5,134.37 31.5,139.19 30.73,139.95
12V  (via drill 0.6)
  Top 0.254: R97.1 45.79,68.58 v47.24,68.58 | R83.1 47.18,102.68 v47.24,102.62 | R85.1 45.79,97.79 v47.24,97.79 | R87.1 45.79,92.96 v47.24,92.96 | R89.1 45.79,88.14 v47.24,88.14 | R91.1 45.79,83.31 v47.24,83.31 | R95.1 45.79,73.66 v47.24,73.66 | R93.1 45.79,78.49 v47.24,78.49
  Top 1.27: C29.P$1 256.92,138.3 255.65,139.57 253.87,139.57 252.55,140.9 DMD_PWR.2
  other vias: 22.86,121.67 22.86,119.89 22.86,118.11 22.86,116.33 24.89,121.67 24.89,119.89 24.89,118.11 24.89,116.33 20.83,116.33
  pour Top (no thermals): 19.81,131.83 19.81,115.57 26.42,115.57 26.42,122.94 23.11,122.94 23.11,129.03 21.84,129.03 21.84,131.83
  pour 12V (isolate 0.305, rank 6): 0,152.15 359.16,152.15 359.16,0 306.53,0 294.39,12.14 294.39,53.09 259.84,53.09 259.84,49.02 111,49.02 111,0 0,0
12V_IN
  Top 0.254: R158.1 20.31,138.56 D4.CATH
  Bottom 0.406: 12V.P$1 14.1,142.49 20.48,142.49 20.88,142.89 BOARD_POWER_IN.3
  pour Top (no thermals): 22.86,148.84 19.05,148.84 19.05,140.46 18.03,139.45 18.03,134.37 22.35,134.37 22.35,139.45 22.86,139.95
50V
  Bottom 0.406: 50V.P$1 283.56,11.18 SOLENOID_POWER_IN.4
  pour Top (isolate 0.813, rank 6, no thermals): 279.15,2.03 284.23,2.03 286.77,4.57 286.77,6.86 291.85,11.94 291.85,27.94 262.64,27.94 262.64,24.38 279.15,8
50V_FUSE_0  (via drill 0.9)  (4 unrouted)
  Top 0.406: D9.ANODE 265.67,47.59 F1.P$2
  3.3V 1.676: KNOCKER.P$1 117.86,37.51 117.86,28.7 124.21,22.35 | SHAKER.P$1 128.83,23.67 128.78,23.62
  3.3V 3.81: SOL_BANK_0.P$1 115.53,13.68 124.21,22.35 125.48,23.62 128.78,23.62 255.78,23.62 259.71,27.56 259.71,43.13 F1.P$2
  5V 1.676: 124.21,22.35 117.86,28.7 117.86,37.51 | SHAKER.P$1 128.83,23.67
  5V 3.81: F1.P$2 259.71,43.13 259.71,27.56 255.78,23.62 125.48,23.62 124.21,22.35 115.53,13.68 SOL_BANK_0.P$1
  12V 0.406: v175.9,23.62 178.44,23.62 178.44,22.86 | v224.79,23.62 224.79,23.5
  12V 1.676: SHAKER.P$1 128.83,23.67 | 124.21,22.35 117.86,28.7 117.86,37.51
  12V 3.81: F1.P$2 259.71,43.13 259.71,27.56 255.78,23.62 v254.63,23.62 v244.47,23.62 v234.31,23.62 v224.79,23.62 v215.26,23.62 v205.1,23.62 v195.58,23.62 v186.06,23.62 v175.9,23.62 v155.57,23.62 v132.08,23.62 125.48,23.62 124.21,22.35 115.53,13.68 SOL_BANK_0.P$1
  other vias: 125.73,23.62 259.71,40.13 259.71,35.05 259.71,27.43
50V_FUSE_1  (via drill 0.9)  (2 unrouted)
  Top 0.406: D10.ANODE 277.86,47.59 F2.P$2
  3.3V 3.81: SOL_BANK_1.P$1 167.39,6.64 167.39,10.92 174.37,17.91 266.19,17.91 272.29,24 272.29,43.51 F2.P$2
  5V 3.81: F2.P$2 272.29,43.51 272.29,24 266.19,17.91 174.37,17.91 167.39,10.92 167.39,6.64 SOL_BANK_1.P$1
  12V 0.406: v173.61,17.78 v197.1,17.78 v214.25,17.78 v225.68,17.78 | v244.73,17.78 v254.89,17.78 v266.32,17.78 | v272.29,40.39 272.42,40.39 272.42,43.18 272.29,43.18 v272.29,24.77
  12V 3.81: F2.P$2 272.29,43.51 v272.29,40.39 v272.29,34.92 v272.29,24.77 272.29,24 266.19,17.91 174.37,17.91 167.39,10.92 167.39,6.64 SOL_BANK_1.P$1
50V_FUSE_2  (via drill 0.9)  (1 unrouted)
  Top 0.406: D11.ANODE 290.06,47.59 F3.P$2
  3.3V 3.81: F3.P$2 284.23,43.26 284.23,18.54 277.88,12.19 222.3,12.19 219.46,9.35 219.46,6.64 SOL_BANK_2.P$1
  5V 3.81: F3.P$2 284.23,43.26 284.23,18.54 277.88,12.19 222.3,12.19 219.46,9.35 219.46,6.64 SOL_BANK_2.P$1
  12V 0.406: v284.1,40.13 v284.1,35.05 | v284.1,24.89 284.23,24.89 284.23,19.05 | v280.92,15.37 279.21,15.37 279.21,13.53 | v246.38,12.06 246.38,12.19 259.08,12.19 v259.08,12.06 v267.33,12.06
  12V 3.81: F3.P$2 284.23,43.26 284.23,19.05 284.23,18.54 279.21,13.53 277.88,12.19 259.08,12.19 222.3,12.19 219.46,9.35 219.46,6.64 SOL_BANK_2.P$1
!DATA_LAT
  Top 0.254: U10.6 317.18,96.96 316.1,95.89 U5.12 316.1,80.9 316.48,80.52 321.06,80.52 327.15,86.61 337.57,86.61 338.45,85.72 U3.12
AUD0
  Top 0.254: U1.16 214.67,91.91 218.69,87.88 221.23,87.88 230.12,78.99 249.17,78.99 253.24,74.93 279.15,74.93 281.94,77.72 281.94,82.55 285.24,85.85 303.02,85.85 308.61,91.44 308.61,105.41 316.48,113.79 319.79,117.09 319.79,133.34 R32.1
AUD1
  Top 0.254: U1.15 214.71,91.11 218.44,87.38 220.98,87.38 229.87,78.49 248.92,78.49 252.98,74.42 279.4,74.42 282.45,77.47 282.45,82.3 285.5,85.34 303.28,85.34 309.12,91.19 309.12,105.16 317.25,113.54 320.68,116.97 320.68,131.69 R34.1
AUX_0  (via drill 0.6)
  Top 0.254: U11.11 333.63,99.69 v333.5,99.82 | v101.85,107.19 101.35,107.7 101.35,108.2 100.84,108.71 R35.1
  Top 0.406: R138.1 R35.1
  Bottom 0.254: v101.85,107.19 116.59,107.19 129.29,119.89 149.86,119.89 152.4,117.35 214.12,117.35 223.01,108.46 326.14,108.46 330.45,104.14 330.45,101.35 331.98,99.82 v333.5,99.82
AUX_1  (via drill 0.6)
  Top 0.254: U11.12 333.63,100.97 v333.5,101.09 | v101.85,112.52 101.35,113.03 101.35,113.79 101.09,114.05 R36.1
  Top 0.406: R31.1 R36.1
  Bottom 0.254: v101.85,112.52 121.16,112.52 129.03,120.4 150.11,120.4 152.65,117.86 214.38,117.86 223.27,108.97 326.39,108.97 330.96,104.39 330.96,102.11 331.98,101.09 v333.5,101.09
AUX_2  (via drill 0.6)
  Top 0.254: U11.13 333.63,102.23 v333.5,102.36 | v101.85,117.86 101.35,118.36 101.35,119.13 101.09,119.38 R37.1
  Top 0.406: R28.1 R37.1